# EAGLE design braids_v50 (EAGLE 9.2.2)

## Sheet 1 of 3
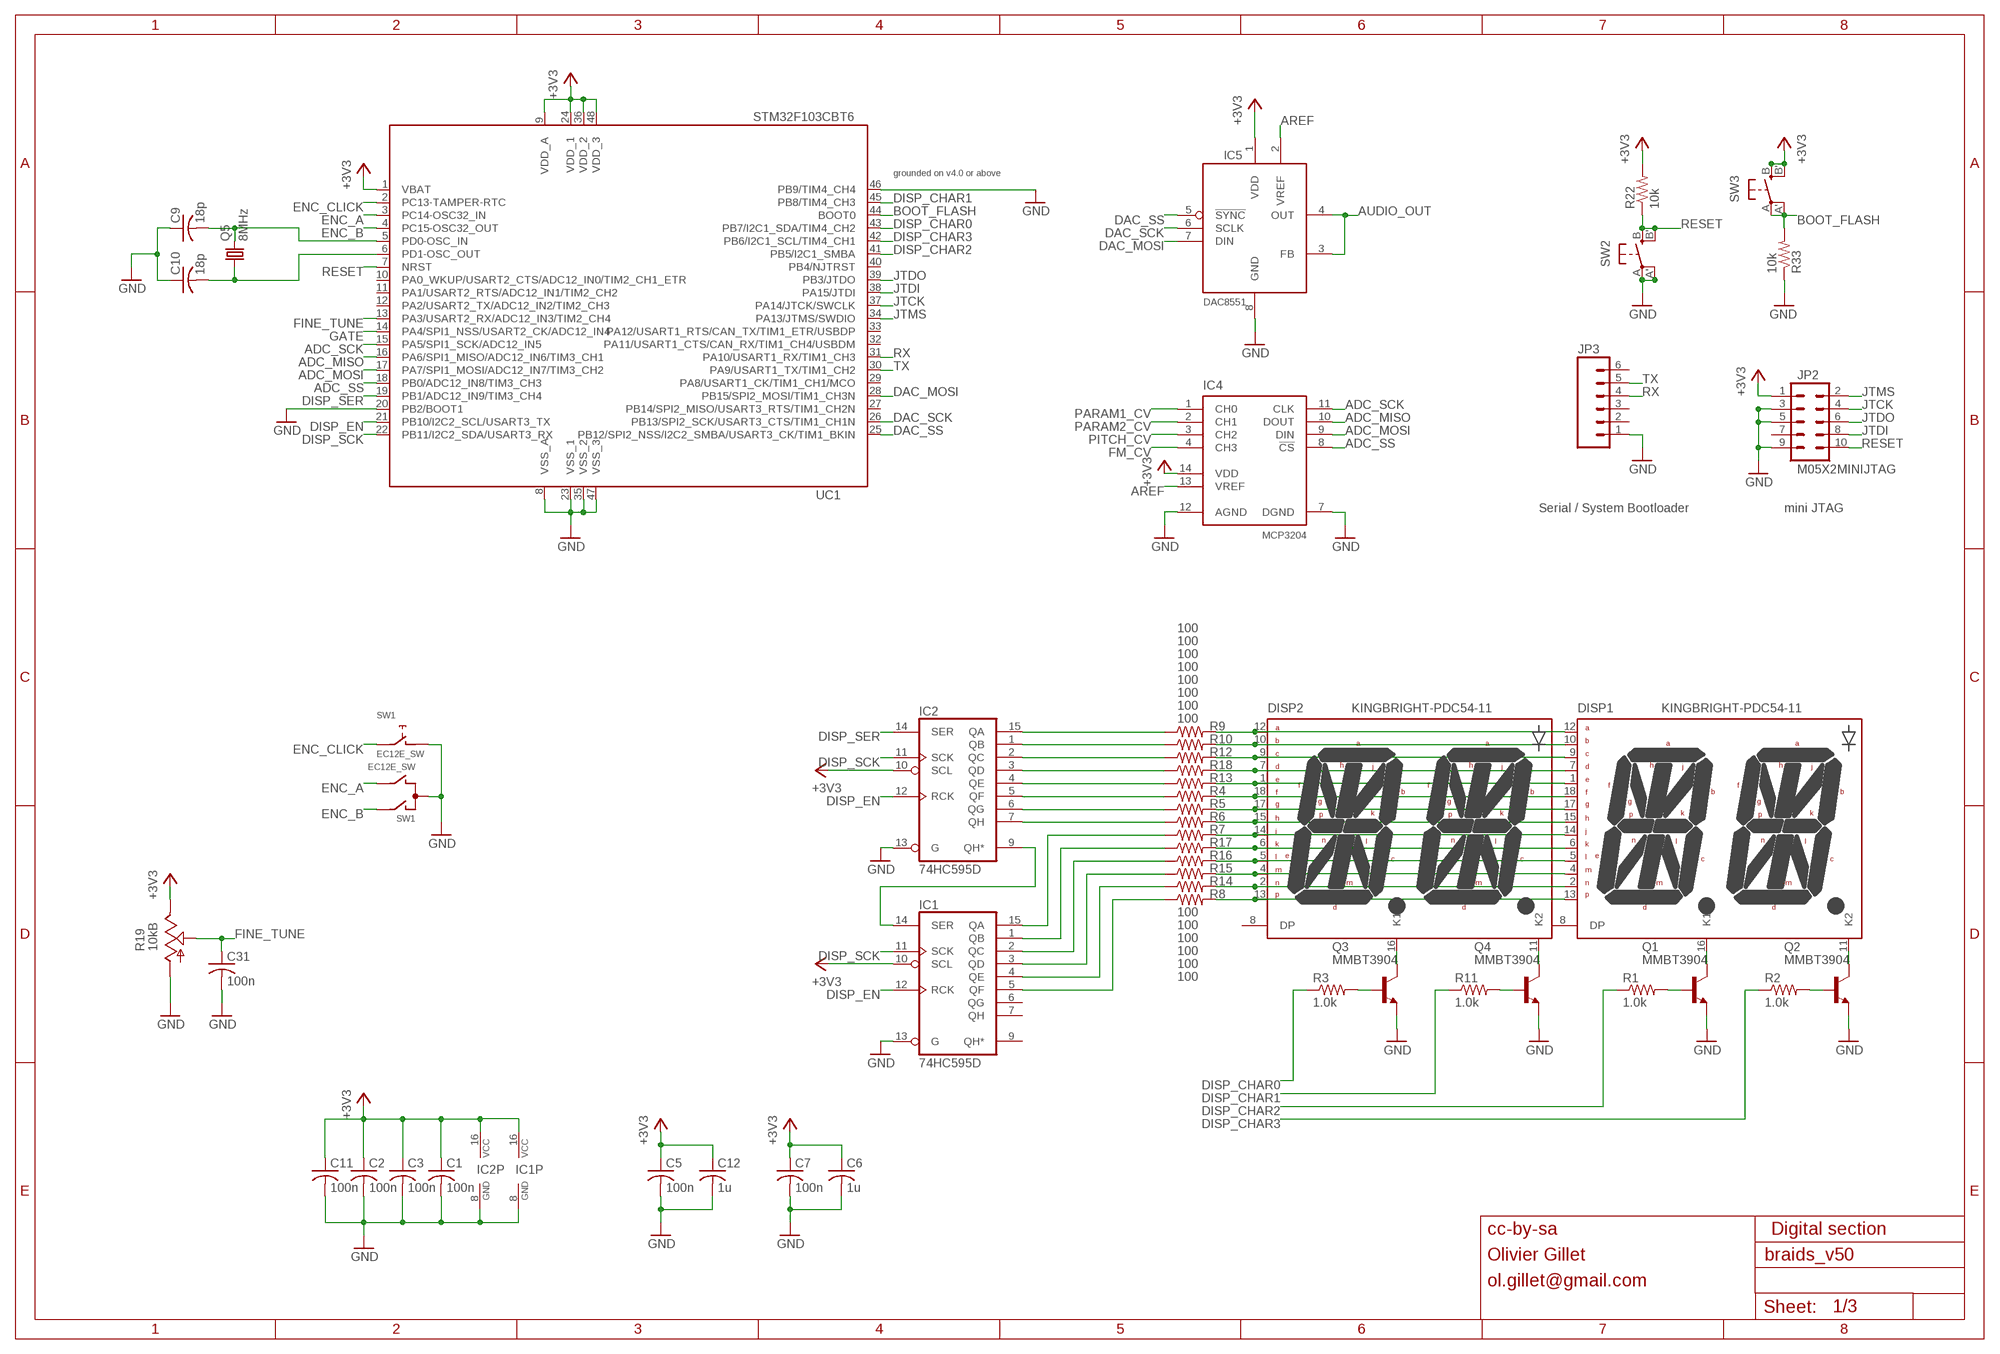
[diagram p0: schematic, sheet 1]

### Parts
C1  100n  C-USC0603  [C0603]
C2  100n  C-USC0603  [C0603]
C3  100n  C-USC0603  [C0603]
C5  100n  C-USC0603  [C0603]
C6  1u  C-USC0603  [C0603]
C7  100n  C-USC0603  [C0603]
C9  18p  C-USC0603  [C0603]
C10  18p  C-USC0603  [C0603]
C11  100n  C-USC0603  [C0603]
C12  1u  C-USC0603  [C0603]
C31  100n  C-USC0603  [C0603]
DISP1  KINGBRIGHT-PDC54-11  [PDC54]
DISP2  KINGBRIGHT-PDC54-11  [PDC54]
IC1  74HC595D  [SO16]
IC2  74HC595D  [SO16]
IC4  MCP3204  MCP3302  [SO14]
IC5  DAC8551  DAC855X  [MSOP-8]
JP2  M05X2MINIJTAG  [2X5-1.27]
JP3  M06SIP  [1X06]
Q1  MMBT3904  MMBT3904LT1-NPN-SOT23-BEC  [SOT23-BEC]
Q2  MMBT3904  MMBT3904LT1-NPN-SOT23-BEC  [SOT23-BEC]
Q3  MMBT3904  MMBT3904LT1-NPN-SOT23-BEC  [SOT23-BEC]
Q4  MMBT3904  MMBT3904LT1-NPN-SOT23-BEC  [SOT23-BEC]
Q5  8MHz  CRYSTALHC49UP  [HC49UP]
R1  1.0k  R-US_R0603  [R0603]
R2  1.0k  R-US_R0603  [R0603]
R3  1.0k  R-US_R0603  [R0603]
R4  100  R-US_R0603  [R0603]
R5  100  R-US_R0603  [R0603]
R6  100  R-US_R0603  [R0603]
R7  100  R-US_R0603  [R0603]
R8  100  R-US_R0603  [R0603]
R9  100  R-US_R0603  [R0603]
R10  100  R-US_R0603  [R0603]
R11  1.0k  R-US_R0603  [R0603]
R12  100  R-US_R0603  [R0603]
R13  100  R-US_R0603  [R0603]
R14  100  R-US_R0603  [R0603]
R15  100  R-US_R0603  [R0603]
R16  100  R-US_R0603  [R0603]
R17  100  R-US_R0603  [R0603]
R18  100  R-US_R0603  [R0603]
R19  10kB  POT_USVERTICAL_PS  [ALPS_POT_VERTICAL_PS]
R22  10k  R-US_R0603  [R0603]
R33  10k  R-US_R0603  [R0603]
SW1  EC12E_SW  [ALPS_EC12E_SW]
SW2  EVQQ2  [EVQ-Q2]
SW3  EVQQ2  [EVQ-Q2]
UC1  STM32F103CBT6  STM32F103CB  [LQFP48]

### Nets
+3V3: C1.1 C2.1 C3.1 C5.1 C6.1 C7.1 C11.1 C12.1 IC1.10(SCL) IC1.16(VCC) IC2.10(SCL) IC2.16(VCC) IC4.14(VDD) IC5.1(VDD) JP2.1 R19.P$1(E) R22.2 SW3.B'(S1) SW3.B(S) UC1.1(VBAT) UC1.9(VDD_A) UC1.24(VDD_1) UC1.36(VDD_2) UC1.48(VDD_3) ; also sheet 2,3
ADC_MISO: IC4.10(DOUT) UC1.16(PA6/SPI1_MISO/ADC12_IN6/TIM3_CH1)
ADC_MOSI: IC4.9(DIN) UC1.17(PA7/SPI1_MOSI/ADC12_IN7/TIM3_CH2)
ADC_SCK: IC4.11(CLK) UC1.15(PA5/SPI1_SCK/ADC12_IN5)
ADC_SS: IC4.8(!CS) UC1.18(PB0/ADC12_IN8/TIM3_CH3)
AREF: IC4.13(VREF) IC5.2(VREF) ; also sheet 3
AUDIO_OUT: IC5.3(FB) IC5.4(OUT) ; also sheet 2
BOOT_FLASH: R33.2 SW3.A'(P1) SW3.A(P) UC1.44(BOOT0)
DAC_MOSI: IC5.7(DIN) UC1.28(PB15/SPI2_MOSI/TIM1_CH3N)
DAC_SCK: IC5.6(SCLK) UC1.26(PB13/SPI2_SCK/USART3_CTS/TIM1_CH1N)
DAC_SS: IC5.5(!SYNC) UC1.25(PB12/SPI2_NSS/I2C2_SMBA/USART3_CK/TIM1_BKIN)
DISP_CHAR0: R3.1 UC1.43(PB7/I2C1_SDA/TIM4_CH2)
DISP_CHAR1: R11.1 UC1.45(PB8/TIM4_CH3)
DISP_CHAR2: R1.1 UC1.41(PB5/I2C1_SMBA)
DISP_CHAR3: R2.1 UC1.42(PB6/I2C1_SCL/TIM4_CH1)
DISP_EN: IC1.12(RCK) IC2.12(RCK) UC1.21(PB10/I2C2_SCL/USART3_TX)
DISP_SCK: IC1.11(SCK) IC2.11(SCK) UC1.22(PB11/I2C2_SDA/USART3_RX)
DISP_SER: IC2.14(SER) UC1.19(PB1/ADC12_IN9/TIM3_CH4)
ENC_A: SW1.B UC1.3(PC14-OSC32_IN)
ENC_B: SW1.A UC1.4(PC15-OSC32_OUT)
ENC_CLICK: SW1.E UC1.2(PC13-TAMPER-RTC)
FINE_TUNE: C31.1 R19.P$2(S) UC1.13(PA3/USART2_RX/ADC12_IN3/TIM2_CH4)
FM_CV: IC4.4(CH3) ; also sheet 2
GATE: UC1.14(PA4/SPI1_NSS/USART2_CK/ADC12_IN4) ; also sheet 2
GND: C1.2 C2.2 C3.2 C5.2 C6.2 C7.2 C9.1 C10.1 C11.2 C12.2 C31.2 IC1.8(GND) IC1.13(G) IC2.8(GND) IC2.13(G) IC4.7(DGND) IC4.12(AGND) IC5.8(GND) JP2.3 JP2.5 JP2.9 JP3.1 Q1.E Q2.E Q3.E Q4.E R19.P$3(A) R33.1 SW1.C SW1.D SW2.A'(P1) SW2.A(P) UC1.8(VSS_A) UC1.20(PB2/BOOT1) UC1.23(VSS_1) UC1.35(VSS_2) UC1.46(PB9/TIM4_CH4) UC1.47(VSS_3) ; also sheet 2,3
JTCK: JP2.4 UC1.37(PA14/JTCK/SWCLK)
JTDI: JP2.8 UC1.38(PA15/JTDI)
JTDO: JP2.6 UC1.39(PB3/JTDO)
JTMS: JP2.2 UC1.34(PA13/JTMS/SWDIO)
N$1: DISP2.16(K1) Q3.C
N$2: DISP2.11(K2) Q4.C
N$3: DISP1.16(K1) Q1.C
N$4: DISP1.11(K2) Q2.C
N$5: Q3.B R3.2
N$6: Q4.B R11.2
N$7: C9.2 Q5.2 UC1.5(PD0-OSC_IN)
N$8: C10.2 Q5.1 UC1.6(PD1-OSC_OUT)
N$9: Q1.B R1.2
N$10: Q2.B R2.2
N$15: DISP1.12(A) DISP2.12(A) R9.2
N$16: DISP1.10(B) DISP2.10(B) R10.2
N$17: DISP1.9(C) DISP2.9(C) R12.2
N$18: DISP1.7(D) DISP2.7(D) R18.2
N$19: DISP1.1(E) DISP2.1(E) R13.2
N$20: DISP1.18(F) DISP2.18(F) R4.2
N$21: DISP1.17(G) DISP2.17(G) R5.2
N$22: DISP1.15(H) DISP2.15(H) R6.2
N$23: DISP1.14(J) DISP2.14(J) R7.2
N$24: DISP1.6(K) DISP2.6(K) R17.2
N$25: DISP1.5(L) DISP2.5(L) R16.2
N$26: DISP1.4(M) DISP2.4(M) R15.2
N$27: DISP1.2(N) DISP2.2(N) R14.2
N$28: DISP1.13(P) DISP2.13(P) R8.2
N$30: IC2.7(QH) R6.1
N$31: IC1.14(SER) IC2.9(QH*)
N$32: IC2.15(QA) R9.1
N$33: IC2.1(QB) R10.1
N$34: IC2.2(QC) R12.1
N$35: IC2.3(QD) R18.1
N$36: IC2.4(QE) R13.1
N$37: IC2.5(QF) R4.1
N$38: IC2.6(QG) R5.1
N$39: IC1.15(QA) R7.1
N$40: IC1.1(QB) R17.1
N$41: IC1.2(QC) R16.1
N$42: IC1.3(QD) R15.1
N$43: IC1.4(QE) R14.1
N$44: IC1.5(QF) R8.1
PARAM1_CV: IC4.1(CH0) ; also sheet 2
PARAM2_CV: IC4.2(CH1) ; also sheet 2
PITCH_CV: IC4.3(CH2) ; also sheet 2
RESET: JP2.10 R22.1 SW2.B'(S1) SW2.B(S) UC1.7(NRST)
RX: JP3.4 UC1.31(PA10/USART1_RX/TIM1_CH3)
TX: JP3.5 UC1.30(PA9/USART1_TX/TIM1_CH2)
Unconnected: DISP1.8(DP) DISP2.8(DP) IC1.6(QG) IC1.7(QH) IC1.9(QH*) JP2.7 JP3.2 JP3.3 JP3.6 SW1.GND1(G) SW1.GND2(G) UC1.10(PA0_WKUP/USART2_CTS/ADC12_IN0/TIM2_CH1_ETR) UC1.11(PA1/USART2_RTS/ADC12_IN1/TIM2_CH2) UC1.12(PA2/USART2_TX/ADC12_IN2/TIM2_CH3) UC1.27(PB14/SPI2_MISO/USART3_RTS/TIM1_CH2N) UC1.29(PA8/USART1_CK/TIM1_CH1/MCO) UC1.32(PA11/USART1_CTS/CAN_RX/TIM1_CH4/USBDM) UC1.33(PA12/USART1_RTS/CAN_TX/TIM1_ETR/USBDP) UC1.40(PB4/NJTRST)

### Notes on the sheet
- grounded on v4.0 or above
- Serial / System Bootloader | mini JTAG
- cc-by-sa | Digital section
- Olivier Gillet
- ol.gillet@gmail.com

## Sheet 2 of 3
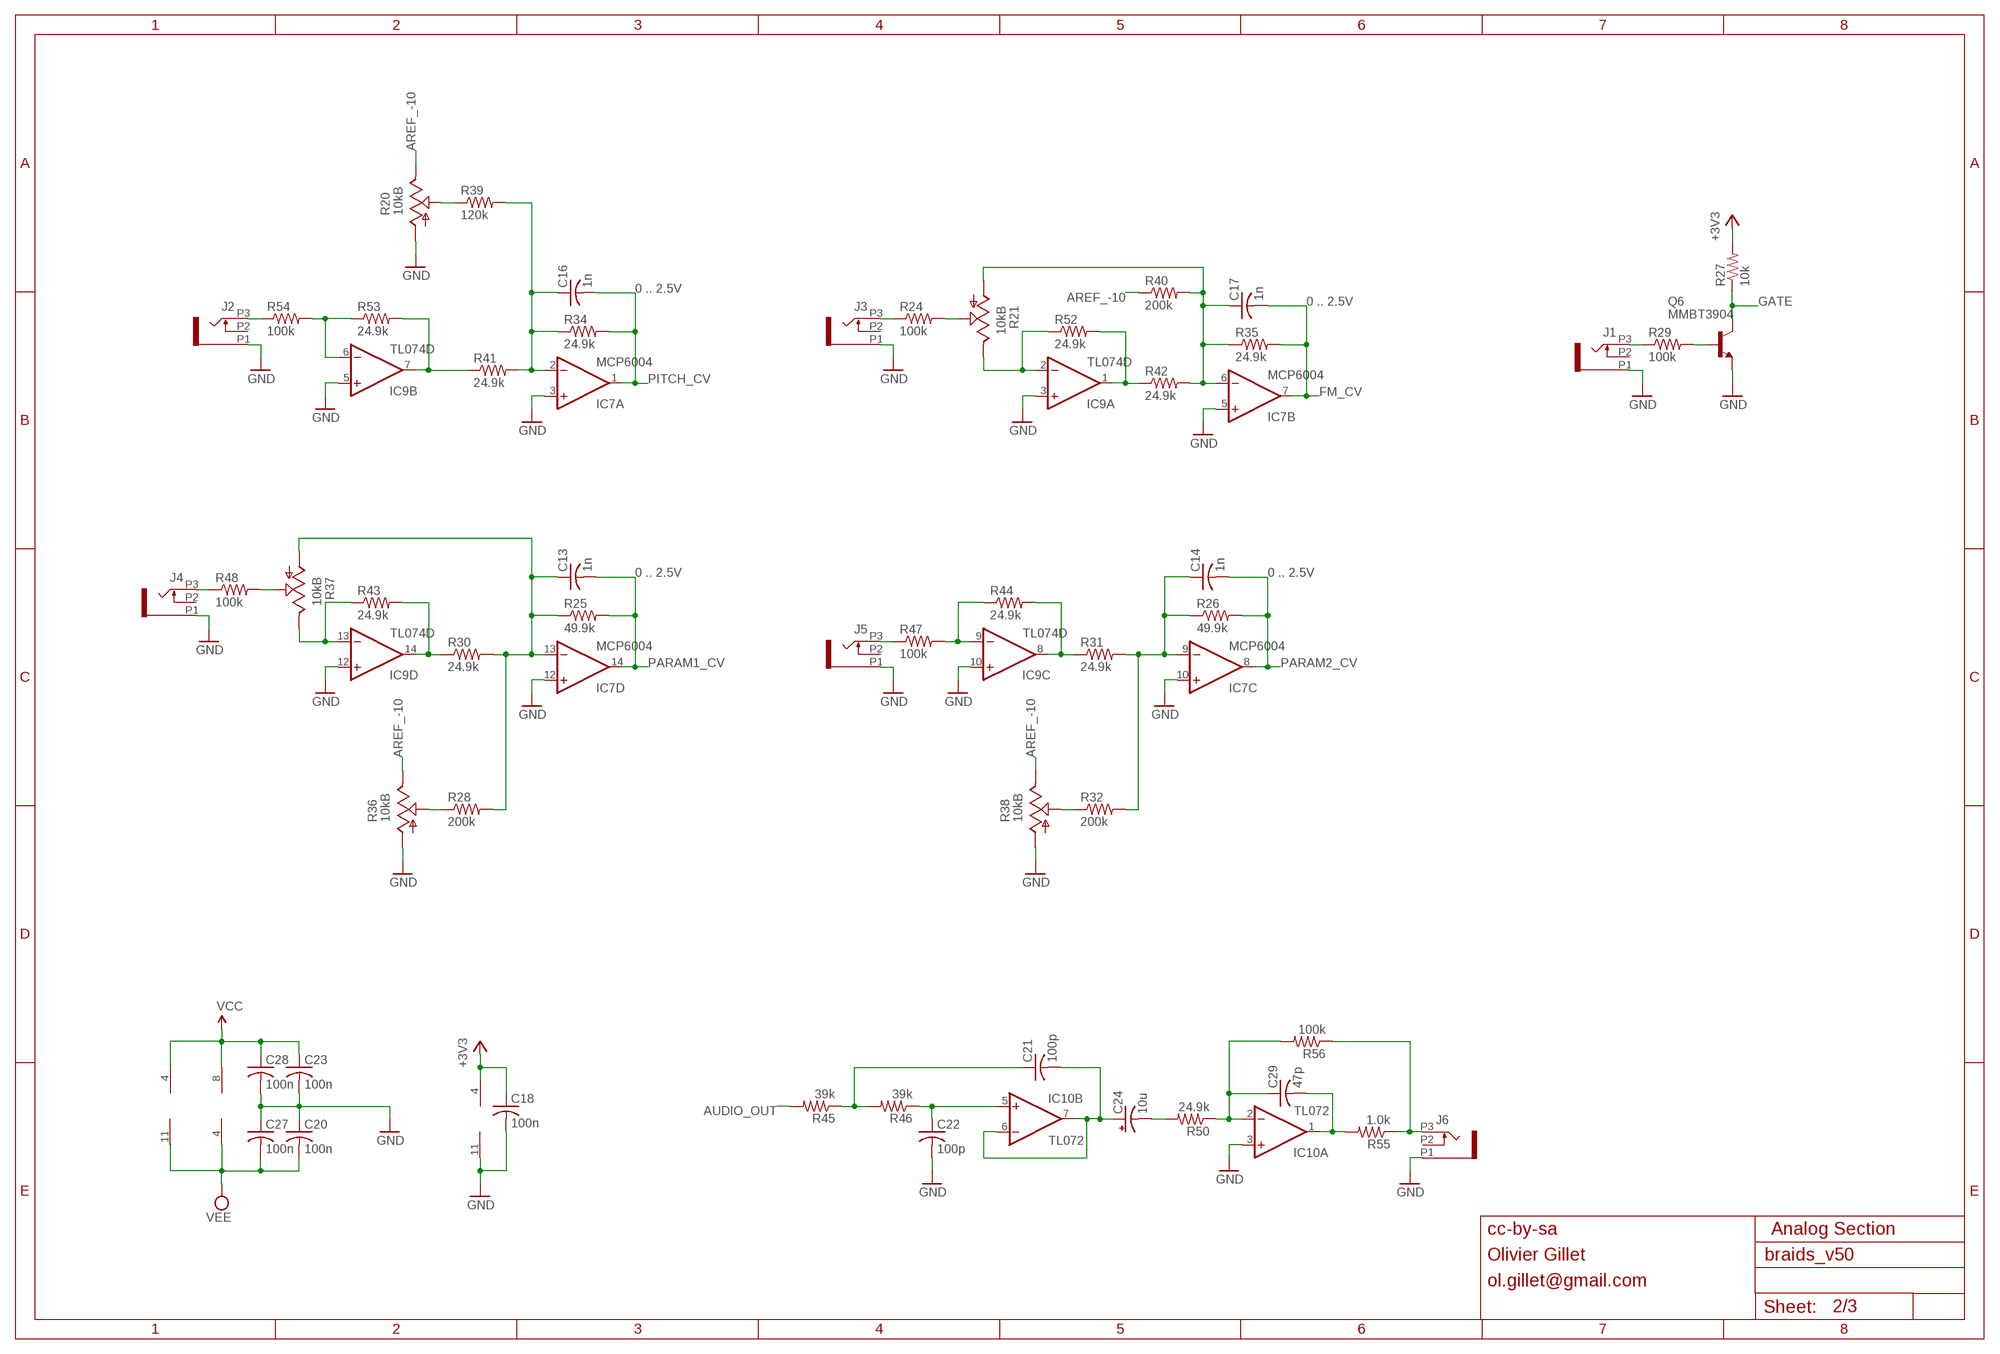
[diagram p1: schematic, sheet 2]

### Parts
C13  1n  C-USC0603  [C0603]
C14  1n  C-USC0603  [C0603]
C16  1n  C-USC0603  [C0603]
C17  1n  C-USC0603  [C0603]
C18  100n  C-USC0603  [C0603]
C20  100n  C-USC0603  [C0603]
C21  100p  C-USC0603  [C0603]
C22  100p  C-USC0603  [C0603]
C23  100n  C-USC0603  [C0603]
C24  10u  CPOL-USB  [PANASONIC_B]
C27  100n  C-USC0603  [C0603]
C28  100n  C-USC0603  [C0603]
C29  47p  C-USC0603  [C0603]
IC7  MCP6004  TL074D  [SO14]
IC9  TL074D  [SO14]
IC10  TL072  TL072D  [SO08]
J1  PJ301_THONKICONN6  [WQP_PJ_301M6]
J2  PJ301_THONKICONN6  [WQP_PJ_301M6]
J3  PJ301_THONKICONN6  [WQP_PJ_301M6]
J4  PJ301_THONKICONN6  [WQP_PJ_301M6]
J5  PJ301_THONKICONN6  [WQP_PJ_301M6]
J6  PJ301_THONKICONN6  [WQP_PJ_301M6]
Q6  MMBT3904  MMBT3904LT1-NPN-SOT23-BEC  [SOT23-BEC]
R20  10kB  POT_USVERTICAL_PS  [ALPS_POT_VERTICAL_PS]
R21  10kB  POT_USVERTICAL_PS  [ALPS_POT_VERTICAL_PS]
R24  100k  R-US_R0603  [R0603]
R25  49.9k  R-US_R0603  [R0603]
R26  49.9k  R-US_R0603  [R0603]
R27  10k  R-US_R0603  [R0603]
R28  200k  R-US_R0603  [R0603]
R29  100k  R-US_R0603  [R0603]
R30  24.9k  R-US_R0603  [R0603]
R31  24.9k  R-US_R0603  [R0603]
R32  200k  R-US_R0603  [R0603]
R34  24.9k  R-US_R0603  [R0603]
R35  24.9k  R-US_R0603  [R0603]
R36  10kB  POT_USVERTICAL_PS  [ALPS_POT_VERTICAL_PS]
R37  10kB  POT_USVERTICAL_PS  [ALPS_POT_VERTICAL_PS]
R38  10kB  POT_USVERTICAL_PS  [ALPS_POT_VERTICAL_PS]
R39  120k  R-US_R0603  [R0603]
R40  200k  R-US_R0603  [R0603]
R41  24.9k  R-US_R0603  [R0603]
R42  24.9k  R-US_R0603  [R0603]
R43  24.9k  R-US_R0603  [R0603]
R44  24.9k  R-US_R0603  [R0603]
R45  39k  R-US_R0603  [R0603]
R46  39k  R-US_R0603  [R0603]
R47  100k  R-US_R0603  [R0603]
R48  100k  R-US_R0603  [R0603]
R50  24.9k  R-US_R0603  [R0603]
R52  24.9k  R-US_R0603  [R0603]
R53  24.9k  R-US_R0603  [R0603]
R54  100k  R-US_R0603  [R0603]
R55  1.0k  R-US_R0603  [R0603]
R56  100k  R-US_R0603  [R0603]

### Nets
+3V3: C18.1 IC7.4(P:V+) R27.2 ; also sheet 1,3
AREF_-10: R20.P$1(E) R36.P$1(E) R38.P$1(E) R40.1 ; also sheet 3
AUDIO_OUT: R45.2 ; also sheet 1
FM_CV: C17.2 IC7.7(B:OUT) R35.2 ; also sheet 1
GATE: Q6.C R27.1 ; also sheet 1
GND: C18.2 C20.1 C22.2 C23.2 C27.1 C28.2 IC7.3(A:+IN) IC7.5(B:+IN) IC7.10(C:+IN) IC7.11(P:V-) IC7.12(D:+IN) IC9.3(A:+IN) IC9.5(B:+IN) IC9.10(C:+IN) IC9.12(D:+IN) IC10.3(A:+IN) J1.P1 J2.P1 J3.P1 J4.P1 J5.P1 J6.P1 Q6.E R20.P$3(A) R36.P$3(A) R38.P$3(A) ; also sheet 1,3
N$12: IC9.7(B:OUT) R41.1 R53.2
N$13: R20.P$2(S) R39.1
N$14: J2.P3 R54.1
N$29: C16.1 IC7.2(A:-IN) R34.1 R39.2 R41.2
N$45: IC9.6(B:-IN) R53.1 R54.2
N$46: J3.P3 R24.1
N$47: J4.P3 R48.1
N$48: R21.P$2(S) R24.2
N$50: IC9.13(D:-IN) R37.P$1(E) R43.1
N$51: IC9.14(D:OUT) R30.1 R43.2
N$52: IC9.2(A:-IN) R21.P$1(E) R52.1
N$53: IC9.1(A:OUT) R42.1 R52.2
N$55: C17.1 IC7.6(B:-IN) R21.P$3(A) R35.1 R40.2 R42.2
N$57: J1.P3 R29.1
N$58: IC9.8(C:OUT) R31.1 R44.2
N$59: C13.1 IC7.13(D:-IN) R25.1 R28.2 R30.2 R37.P$3(A)
N$60: J5.P3 R47.1
N$61: R28.1 R36.P$2(S)
N$62: R37.P$2(S) R48.2
N$63: IC9.9(C:-IN) R44.1 R47.2
N$65: R32.1 R38.P$2(S)
N$66: Q6.B R29.2
N$67: C21.2 C24.+ IC10.6(B:-IN) IC10.7(B:OUT)
N$68: C24.- R50.2
N$69: C22.1 IC10.5(B:+IN) R46.1
N$70: C14.1 IC7.9(C:-IN) R26.1 R31.2 R32.2
N$71: C21.1 R45.1 R46.2
N$72: J6.P3 R55.1 R56.1
N$73: C29.2 IC10.1(A:OUT) R55.2
N$75: C29.1 IC10.2(A:-IN) R50.1 R56.2
PARAM1_CV: C13.2 IC7.14(D:OUT) R25.2 ; also sheet 1
PARAM2_CV: C14.2 IC7.8(C:OUT) R26.2 ; also sheet 1
PITCH_CV: C16.2 IC7.1(A:OUT) R34.2 ; also sheet 1
VCC: C23.1 C28.1 IC9.4(P:V+) IC10.8(P:V+) ; also sheet 3
VEE: C20.2 C27.2 IC9.11(P:V-) IC10.4(P:V-) ; also sheet 3
Unconnected: J1.P2 J2.P2 J3.P2 J4.P2 J5.P2 J6.P2

### Notes on the sheet
- 0 .. 2.5V
- 0 .. 2.5V
- 0 .. 2.5V | 0 .. 2.5V
- cc-by-sa | Analog Section
- Olivier Gillet
- ol.gillet@gmail.com

## Sheet 3 of 3
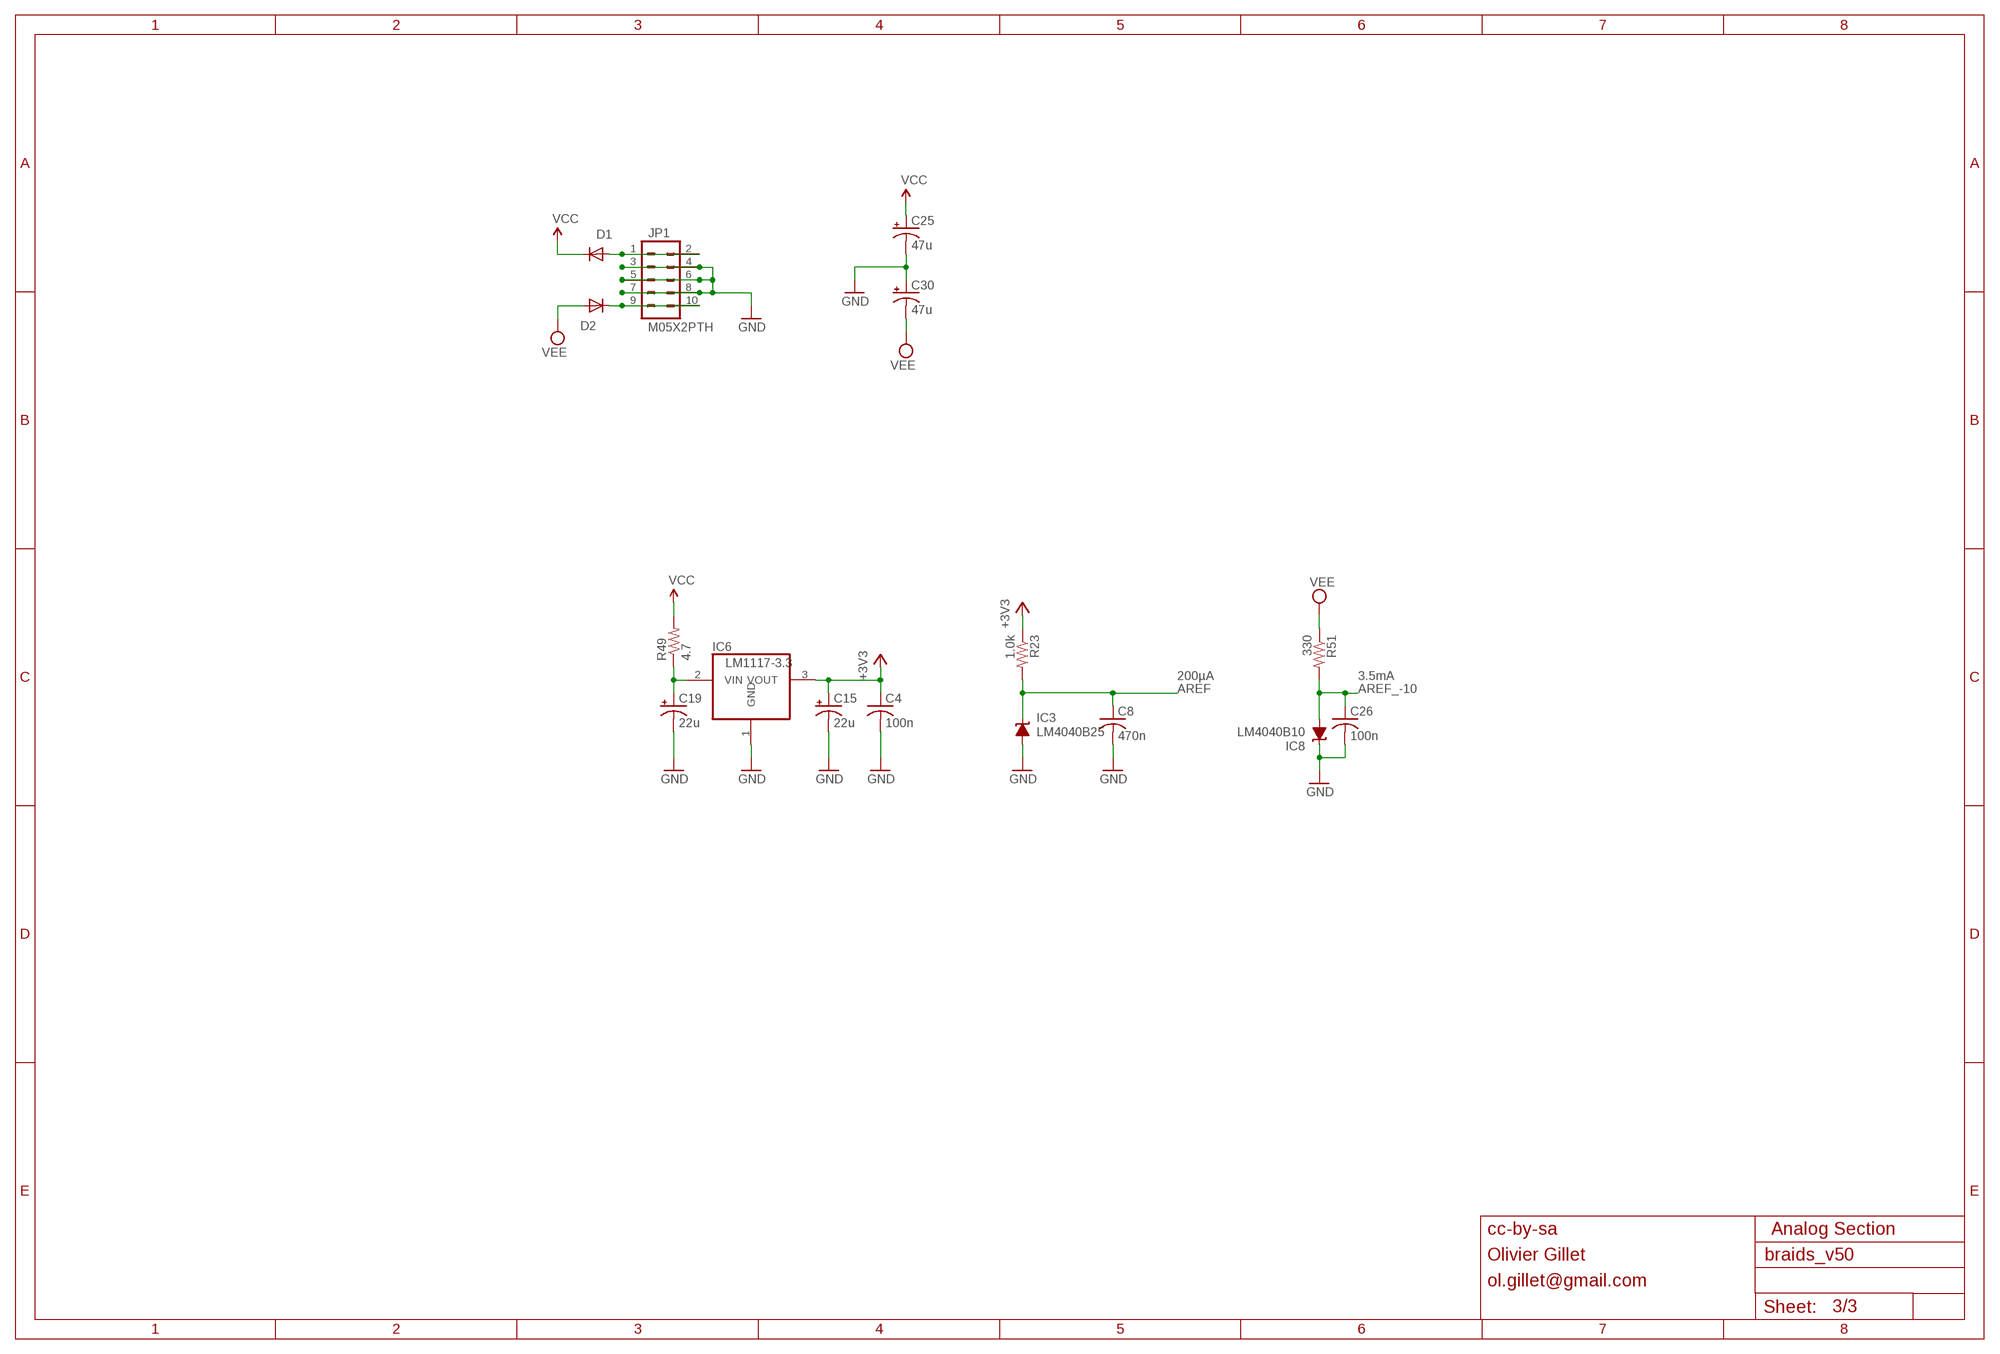
[diagram p2: schematic, sheet 3]

### Parts
C4  100n  C-USC0603  [C0603]
C8  470n  C-USC0603  [C0603]
C15  22u  CPOL-USC  [PANASONIC_C]
C19  22u  CPOL-USC  [PANASONIC_C]
C25  47u  CPOL-USD  [PANASONIC_D]
C26  100n  C-USC0603  [C0603]
C30  47u  CPOL-USD  [PANASONIC_D]
D1  1N5819HW  DIODE-SOD123  [SOD123]
D2  1N5819HW  DIODE-SOD123  [SOD123]
IC3  LM4040B25  LM4041B12DBZ  [DBZ_R-PDSO-G3]
IC6  LM1117-3.3  REG1117T  [TO252]
IC8  LM4040B10  LM4041B12DBZ  [DBZ_R-PDSO-G3]
JP1  M05X2PTH  [AVR_ICSP]
R23  1.0k  R-US_R0603  [R0603]
R49  4.7  R-US_R1206  [R1206]
R51  330  R-US_R0603  [R0603]

### Nets
+3V3: C4.1 C15.+ IC6.3(VOUT) R23.1 ; also sheet 1,2
AREF: C8.1 IC3.1(C) R23.2 ; also sheet 1
AREF_-10: C26.1 IC8.2(A) R51.2 ; also sheet 2
GND: C4.2 C8.2 C15.- C19.- C25.- C26.2 C30.+ IC3.2(A) IC6.1(GND) IC8.1(C) JP1.3 JP1.4 JP1.5 JP1.6 JP1.7 JP1.8 ; also sheet 1,2
N$49: C19.+ IC6.2(VIN) R49.1
N$56: D1.A JP1.1 JP1.2
N$64: D2.C JP1.9 JP1.10
VCC: C25.+ D1.C R49.2 ; also sheet 2
VEE: C30.- D2.A R51.1 ; also sheet 2

### Notes on the sheet
- 200µA | 3.5mA
- cc-by-sa | Analog Section
- Olivier Gillet
- ol.gillet@gmail.com

## Library data of the parts
C1-C14 C16-C18 C20-C23 C26-C29 C31 = rcl:C-US: CAPACITOR, American symbol
C15 C19 C24 C25 C30 = rcl:CPOL-US: POLARIZED CAPACITOR, American symbol
D1 D2 = diode:DIODE-: DIODE
DISP1 DISP2 = og-display:KINGBRIGHT-PDC54-11: Kingbright PDC54-11GWA ; also compatible with LITE-On LTP-3784G or Avago HDSP-A27C
IC1 IC2 = 74xx-eu:74*595: 8-bit SHIFT REGISTER, output latch
IC3 IC8 = texas:LM4041: PRECISION MICROPOWER SHUNT VOLTAGE REFERENCE Source: http://focus.ti.com/lit/ds/slcs146e/slcs146e.pdf
IC4 = og-adc:MCP3302
IC5 = og-dac:DAC855X: 16-bit low-glitch DAC with 2's complement (8550) or unsigned code (8551)
IC6 = og-vreg:REG1117: 800mA and 1A Low Dropout (LDO) Positive Regulator 1.8V, 2.5V, 2.85V, 3.3V, 5V, and Adj
IC7 IC9 = gm-ics:TL074: OP AMP
IC10 = linear:TL072: OP AMP
J1-J6 = og-pj301:PJ301_THONKICONN
JP1 JP2 = og-header:M05X2: Header 5x2 Standard 10-pin dual row 0.1" header. Commonly used with AVR-ISP. Use with Spark Fun Electronics SKU: PRT-00778
JP3 = SparkFun:M06: Header 6 Standard 6-pin 0.1" header. Use with straight break away headers (SKU : PRT-00116), right angle break away headers (PRT-00553), swiss pins (PRT-00743), machine pins (PRT-00117), and female headers (PRT-00115). Molex polarized connector foot print use with SKU : PRT-08094 with associated crimp pins and housings. NOTES ON THE VARIANTS LOCK and LOCK_LONGPADS... This footprint was designed to help hold the alignment of a through-hole component (i.e. 6-pin header) while soldering it into place. You may notice that each hole has been shifted either up or down by 0.005 of an inch from it's more standard position (which is a perfectly straight line). This slight alteration caused the pins (the squares in the middle) to touch the edges of the holes. Because they are alternating, it causes a "brace" to hold the component in place. 0.005 has proven to be the perfect amount of "off-center" position when using our standard breakaway headers. Although looks a little odd when you look at the bare footprint, once you have a header in there, the alteration is very hard to notice. Also, if you push a header all the way into place, it is covered up entirely on the bottom side. This idea of altering the position of holes to aid alignment will be further integrated into the Sparkfun Library for other footprints. It can help hold any component with 3 or more connection pins.
Q1-Q4 Q6 = transistor:*-NPN-: NPN Transistror BF959 corrected 2008.03.06
Q5 = crystal:CRYSTAL: CRYSTAL
R1-R18 R22-R35 R39-R56 = rcl:R-US_: RESISTOR, American symbol
R19-R21 R36-R38 = pot-alps:POT_US
SW1 = og-encoder:EC12E_SW: ALPS rotary Encoder EC12E series with switch
SW2 SW3 = adafruit:EVQQ2: SMT 6mm switch, EVQQ2 series http://www.ladyada.net/library/eagle
UC1 = stm32:STM32F103CB

## Board
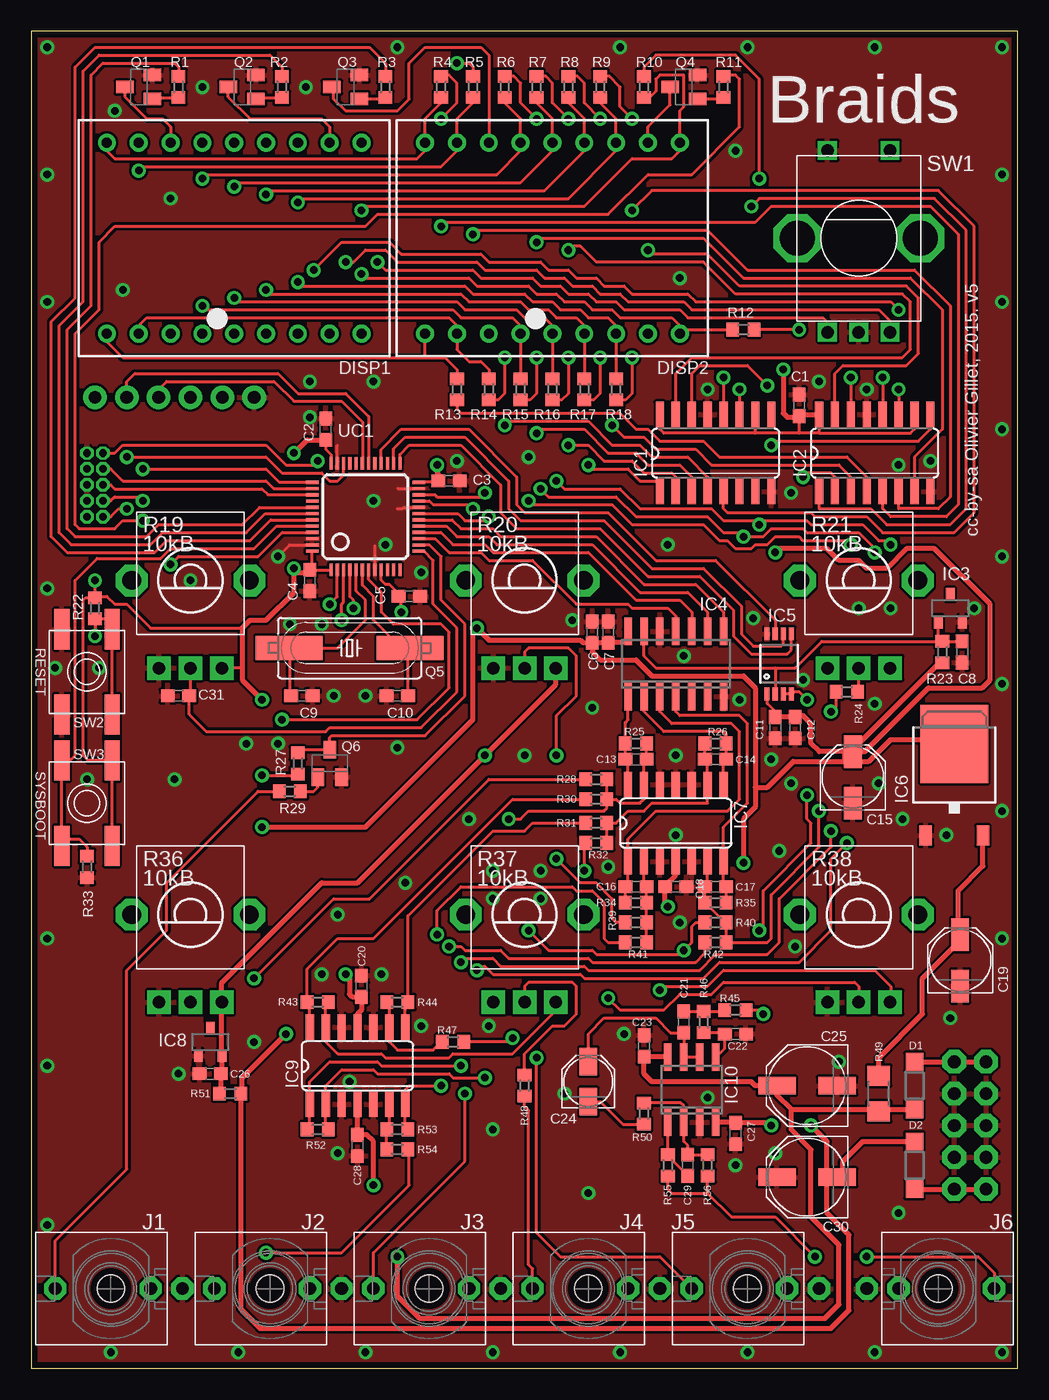
[diagram p3: board, top side]
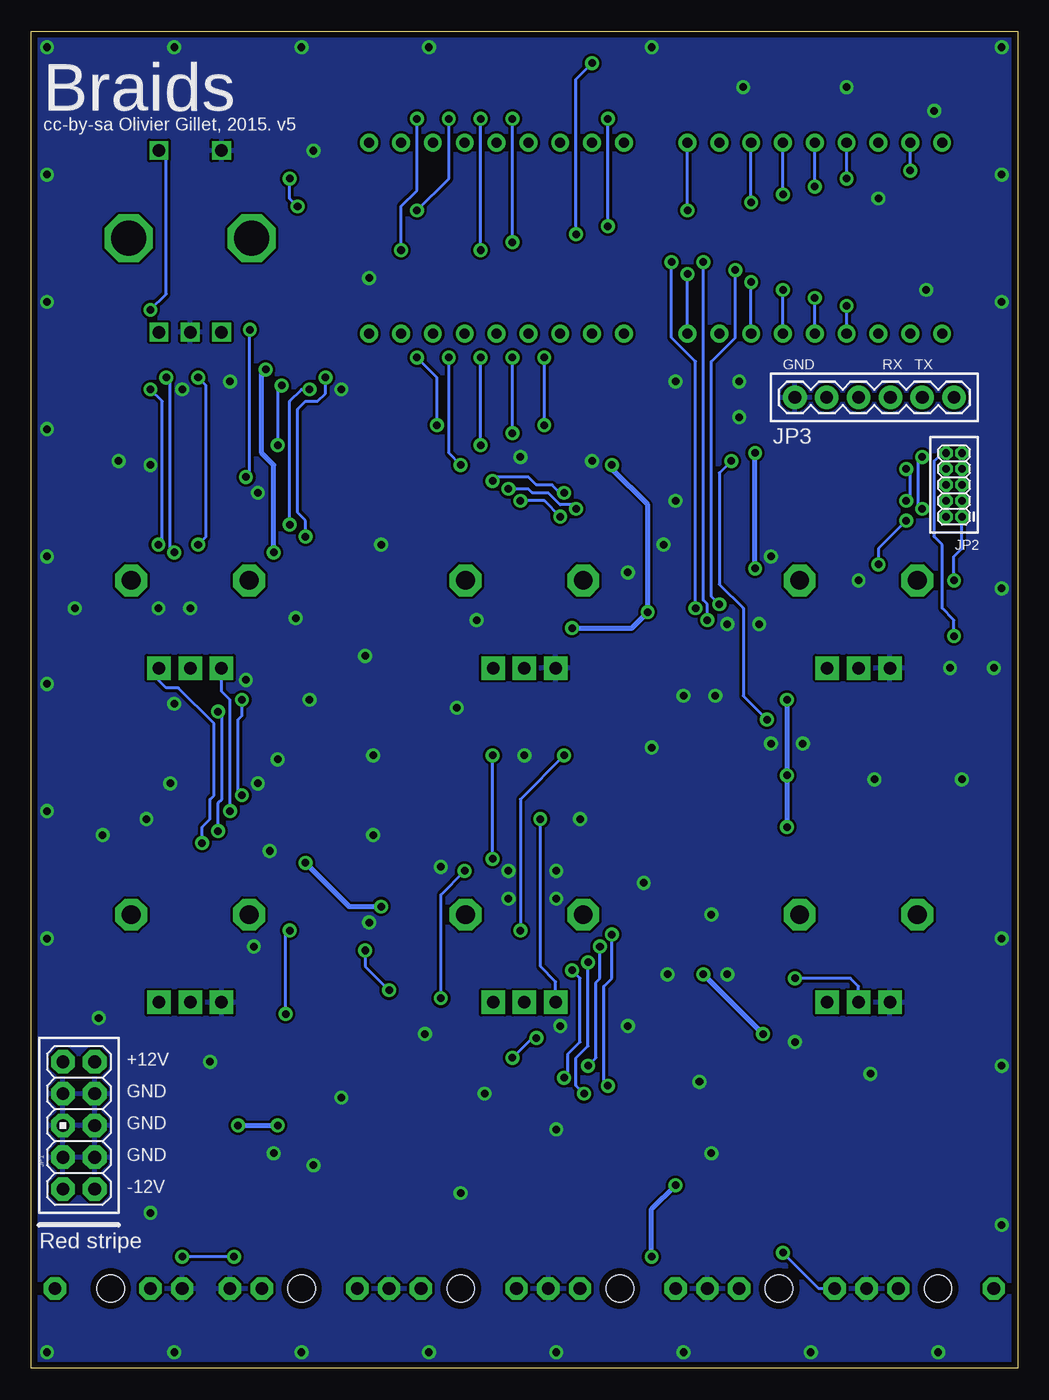
[diagram p4: board, bottom side, seen from below]

Size 78.72 x 106.68 mm. Coordinates in mm from the lower left corner, seen from the top.
Outline: 0,0 78.72,0 78.72,106.68 0,106.68 0,0
Copper layers (1*16): Top 0.035mm / dielectric 1.5mm / Bottom 0.035mm
Design rules "PCBCart-Standard *": minimum track width 8mil, minimum drill 0.4mm, track to track 8mil, track to pad 8mil, pad to pad 8mil, via to via 8mil, smd to smd 8mil, copper to edge 20mil, drill to drill 8mil, minimum pad ring 8mil, minimum via ring 10mil, stop-mask expansion 3mil, vias tented up to drill 25mil, thermal gap 8mil

### Footprints (pad centres in the part's own frame; a part is rotated, then mirrored left to right if it is on the bottom)
C0603 = smd 1.1 x 1: 1 -0.85,0; 2 0.85,0
PANASONIC_C = smd 2.6 x 1.4: + 2.05,0; - -2.05,0
PANASONIC_B = smd 2.2 x 1.4: + 1.6,0; - -1.6,0
PANASONIC_D = smd 3 x 1.4: + 2.4,0; - -2.4,0
SOD123 = smd 1.4 x 1.4: A 1.9,0; C -1.9,0
PDC54 = drill 0.8 pad 1.422: 1 -10.16,-7.62; 2 -7.62,-7.62; 3 -5.08,-7.62; 4 -2.54,-7.62; 5 0,-7.62; 6 2.54,-7.62; 7 5.08,-7.62; 8 7.62,-7.62; 9 10.16,-7.62; 10 10.16,7.62; 11 7.62,7.62; 12 5.08,7.62; 13 2.54,7.62; 14 0,7.62; 15 -2.54,7.62; 16 -5.08,7.62; 17 -7.62,7.62; 18 -10.16,7.62
SO16 = smd 0.66 x 2.032: 1 -4.445,-3.073; 2 -3.175,-3.073; 3 -1.905,-3.073; 4 -0.635,-3.073; 5 0.635,-3.073; 6 1.905,-3.073; 7 3.175,-3.073; 8 4.445,-3.073; 9 4.445,3.073; 10 3.175,3.073; 11 1.905,3.073; 12 0.635,3.073; 13 -0.635,3.073; 14 -1.905,3.073; 15 -3.175,3.073; 16 -4.445,3.073
DBZ_R-PDSO-G3 = smd 0.7 x 1: 1 -0.95,-1.1; 2 0.95,-1.1; 3 0,1.1
SO14 = smd 0.6 x 2.2: 1 -3.81,-2.6; 2 -2.54,-2.6; 3 -1.27,-2.6; 4 0,-2.6; 5 1.27,-2.6; 6 2.54,-2.6; 7 3.81,-2.6; 8 3.81,2.6; 9 2.54,2.6; 10 1.27,2.6; 11 0,2.6; 12 -1.27,2.6; 13 -2.54,2.6; 14 -3.81,2.6
MSOP-8 = smd 0.41 x 1.02: 1 -0.975,-2.4; 2 -0.325,-2.4; 3 0.325,-2.4; 4 0.975,-2.4; 5 0.975,2.4; 6 0.325,2.4; 7 -0.325,2.4; 8 -0.975,2.4
TO252 = smd 1 x 1.6: 1 -2.28,-4.8; 2 2.28,-4.8 | smd 5.4 x 6.2: 3 0,2.5
SO14' = smd 0.66 x 2.032: 1 -3.81,-3.073; 2 -2.54,-3.073; 3 -1.27,-3.073; 4 0,-3.073; 5 1.27,-3.073; 6 2.54,-3.073; 7 3.81,-3.073; 8 3.81,3.073; 9 2.54,3.073; 10 1.27,3.073; 11 0,3.073; 12 -1.27,3.073; 13 -2.54,3.073; 14 -3.81,3.073
SO08 = smd 0.6 x 2.2: 1 -1.905,-2.6; 2 -0.635,-2.6; 3 0.635,-2.6; 4 1.905,-2.6; 5 1.905,2.6; 6 0.635,2.6; 7 -0.635,2.6; 8 -1.905,2.6
WQP_PJ_301M6 = drill 1.016 pad 1.778 octagon: P1 0,-5.715; P2 0,-3.175; P3 0,4.445 | hole 2.2: 0,0
AVR_ICSP = drill 1.016 pad 1.88 octagon: 1 -1.27,5.08; 2 1.27,5.08; 3 -1.27,2.54; 4 1.27,2.54; 5 -1.27,0; 6 1.27,0; 7 -1.27,-2.54; 8 1.27,-2.54; 9 -1.27,-5.08; 10 1.27,-5.08
2X5-1.27 = drill 0.61 pad 1.067 octagon: 1 -1.27,3.81; 2 0,3.81; 3 -1.27,2.54; 4 0,2.54; 5 -1.27,1.27; 6 0,1.27; 7 -1.27,0; 8 0,0; 9 -1.27,-1.27; 10 0,-1.27
1X06 = drill 1.016 pad 1.88: 1 0,0; 2 2.54,0; 3 5.08,0; 4 7.62,0; 5 10.16,0; 6 12.7,0
SOT23-BEC = smd 1 x 1.4: B -0.95,-1.1; C 0,1.1; E 0.95,-1.1
HC49UP = smd 5.334 x 1.93: 1 -4.826,0; 2 4.826,0
R0603 = smd 1 x 1.1: 1 -0.85,0; 2 0.85,0
ALPS_POT_VERTICAL_PS = drill 1 pad 1.88 square: P$1 -2.5,7; P$2 0,7; P$3 2.5,7 | drill 1.5 pad 2.54 octagon: P$4 -4.7,0; P$5 4.7,0
R1206 = smd 1.6 x 1.803: 1 -1.422,0; 2 1.422,0
ALPS_EC12E_SW = drill 1 square: A -2.5,-7.5; B 2.5,-7.5; C 0,-7.5; D -2.5,7; E 2.5,7 | drill 2.8 octagon: GND1 -4.9,0; GND2 4.9,0
EVQ-Q2 = smd 3.2 x 1.2: A -3.4,-2; A' 3.4,-2; B -3.4,2; B' 3.4,2
LQFP48 = smd 0.254 x 1: 1 -2.75,-4.25; 2 -2.25,-4.25; 3 -1.75,-4.25; 4 -1.25,-4.25; 5 -0.75,-4.25; 6 -0.25,-4.25; 7 0.25,-4.25; 8 0.75,-4.25; 9 1.25,-4.25; 10 1.75,-4.25; 11 2.25,-4.25; 12 2.75,-4.25; 25 2.75,4.25; 26 2.25,4.25; 27 1.75,4.25; 28 1.25,4.25; 29 0.75,4.25; 30 0.25,4.25; 31 -0.25,4.25; 32 -0.75,4.25; 33 -1.25,4.25; 34 -1.75,4.25; 35 -2.25,4.25; 36 -2.75,4.25 | smd 1 x 0.254: 13 4.25,-2.75; 14 4.25,-2.25; 15 4.25,-1.75; 16 4.25,-1.25; 17 4.25,-0.75; 18 4.25,-0.25; 19 4.25,0.25; 20 4.25,0.75; 21 4.25,1.25; 22 4.25,1.75; 23 4.25,2.25; 24 4.25,2.75; 37 -4.25,2.75; 38 -4.25,2.25; 39 -4.25,1.75; 40 -4.25,1.25; 41 -4.25,0.75; 42 -4.25,0.25; 43 -4.25,-0.25; 44 -4.25,-0.75; 45 -4.25,-1.25; 46 -4.25,-1.75; 47 -4.25,-2.25; 48 -4.25,-2.75

### Placement (x,y rotation side)
C1  61.28,76.83 90 top
C2  23.5,74.93 90 top
C3  33.34,70.8 0 top
C4  22.23,62.87 270 top
C5  30.16,61.59 0 top
C6  44.77,58.74 90 top
C7  46.04,58.74 90 top
C8  74.3,57.15 270 top
C9  21.59,53.66 180 top
C10  29.21,53.66 0 top
C11  59.37,51.12 270 top
C12  60.96,51.12 270 top
C13  48.26,48.58 180 top
C14  54.61,48.58 0 top
C15  65.56,47.15 90 top
C16  48.26,38.42 180 top
C17  54.61,38.42 0 top
C18  51.44,38.42 0 top
C19  74.14,32.54 90 top
C20  26.35,30.48 270 top
C21  52.07,27.62 270 top
C22  56.2,26.67 0 top
C23  48.9,25.72 90 top
C24  44.45,22.86 90 top
C25  61.91,22.54 180 top
C26  14.29,23.5 180 top
C27  56.2,18.73 90 top
C28  26.04,17.78 270 top
C29  52.39,16.19 270 top
C30  61.91,15.24 180 top
C31  11.75,53.66 180 top
D1  70.48,22.54 90 top
D2  70.48,16.19 90 top
DISP1  16.19,90.17 0 top
DISP2  41.59,90.17 0 top
IC1  54.61,73.03 0 top
IC2  67.31,73.03 0 top
IC3  73.34,60.64 0 top
IC4  51.44,56.2 0 top
IC5  59.69,56.2 0 top
IC6  73.66,47.31 0 top
IC7  MCP6004  [SO14']  51.44,43.5 0 top
IC8  14.29,26.04 0 top
IC9  TL074D  [SO14']  26.04,24.13 0 top
IC10  52.7,22.23 0 top
J1  6.35,6.35 90 top
J2  19.05,6.35 90 top
J3  31.75,6.35 90 top
J4  44.45,6.35 90 top
J5  57.15,6.35 90 top
J6  72.39,6.35 270 top
JP1  74.93,19.37 0 bottom
JP2  5.71,71.75 180 bottom
JP3  17.78,77.47 0 bottom
Q1  8.57,102.23 90 top
Q2  16.83,102.23 90 top
Q3  25.08,102.23 90 top
Q4  52.07,102.23 90 top
Q5  25.4,57.47 180 top
Q6  23.81,48.26 0 top
R1  11.75,102.23 270 top
R2  20,102.23 270 top
R3  28.26,102.23 270 top
R4  32.7,102.23 270 top
R5  35.24,102.23 270 top
R6  37.78,102.23 270 top
R7  40.32,102.23 270 top
R8  42.86,102.23 270 top
R9  45.4,102.23 270 top
R10  48.9,102.23 270 top
R11  55.24,102.23 270 top
R12  56.83,82.87 180 top
R13  33.97,78.11 90 top
R14  36.51,78.11 90 top
R15  39.05,78.11 90 top
R16  41.59,78.11 90 top
R17  44.13,78.11 90 top
R18  46.67,78.11 90 top
R19  12.7,62.87 180 top
R20  39.37,62.87 180 top
R21  66.04,62.87 180 top
R22  5.08,60.64 90 top
R23  72.71,57.15 90 top
R24  65.09,53.98 0 top
R25  48.26,49.85 180 top
R26  54.61,49.85 0 top
R27  21.27,48.26 270 top
R28  45.09,46.99 0 top
R29  20.64,46.04 0 top
R30  45.09,45.4 0 top
R31  45.09,43.5 0 top
R32  45.09,41.91 0 top
R33  4.45,40.01 90 top
R34  48.26,37.15 180 top
R35  54.61,37.15 0 top
R36  12.7,36.2 180 top
R37  39.37,36.2 180 top
R38  66.04,36.2 180 top
R39  48.26,35.56 0 top
R40  54.61,35.56 0 top
R41  48.26,33.97 0 top
R42  54.61,33.97 0 top
R43  22.86,29.21 180 top
R44  29.21,29.21 0 top
R45  56.2,28.57 0 top
R46  53.66,27.62 90 top
R47  33.66,26.04 180 top
R48  39.37,22.54 90 top
R49  67.63,21.91 270 top
R50  48.9,20.32 270 top
R51  15.88,21.91 180 top
R52  22.86,19.05 180 top
R53  29.21,19.05 0 top
R54  29.21,17.46 180 top
R55  50.8,16.19 90 top
R56  53.98,16.19 90 top
SW1  66.04,90.17 0 top
SW2  4.45,55.56 270 top
SW3  4.45,45.09 270 top
UC1  26.67,67.94 0 top

### Tracks (layer width: path | path; a pad name or v marks a point on that pad's centre or on a via)
+3V3  (via drill 0.6)
  Top 0.254: IC1.16 50.16,74.93 50.48,74.61 57.78,74.61 | 62.87,74.61 70.17,74.61 70.48,74.93 IC2.10 | IC2.16 62.87,74.61 | 62.87,74.61 61.28,74.61 | 61.28,74.61 61.28,75.88 | 61.28,74.61 57.78,74.61 | 57.78,74.61 IC1.10 | C2.1 23.5,73.34 23.92,72.92 UC1.36 | R27.2 21.17,47.31 v18.41,47.31 | IC4.14 47.47,58.95 | 32.38,70.91 32.17,70.69 UC1.24 | UC1.48 22.42,63.91 C4.1 22.25,63.7 UC1.1 | UC1.9 27.92,62.88 28.26,62.55 28.57,62.55 29.21,61.91 29.21,61.7 C5.1 29.53,61.38 v29.53,60.33 | IC5.1 58.74,53.77 58.74,53.02 59.37,52.39 C11.1 | SW3.B' SW3.B 4.54,48.48 4.13,48.9 4.13,61.28 4.34,61.49 R22.2 5.18,61.59 | 5.18,61.59 6.03,61.59 6.67,60.96 7.62,60.96 9.53,59.05 16.83,59.05 | 5.18,61.59 5.08,61.7 v5.08,62.87 | R19.P$1 15.21,55.88 16.83,55.88
  Top 0.406: v60.01,79.69 60.01,76.2 60.33,75.88 61.17,75.88 C1.1 61.39,76.1 IC2.16 | v59.37,65.09 59.69,65.41 63.5,65.41 64.45,64.45 66.04,64.45 66.67,63.82 68.26,63.82 69.85,65.41 72.07,65.41 76.52,60.96 76.52,54.93 75.88,54.29 71.6,54.29 66.5,49.2 C15.+ | 32.38,70.91 C3.1 32.49,71.33 32.38,71.44 v32.38,72.07 | C4.1 22.01,63.5 20.95,63.5 v20.95,63.82 20.95,61.91 18.73,59.69 17.46,59.69 16.83,59.05 16.83,55.88 16.83,54.93 v18.41,53.34 | C6.1 44.03,57.89 43.81,58.1 36.51,58.1 v35.56,59.05 35.24,58.74 35.24,51.75 26.67,43.18 v18.41,43.18 | C6.1 44.77,57.15 45.4,56.52 48.26,56.52 49.53,55.24 56.83,55.24 57.78,54.29 57.78,46.35 | v56.83,40.32 56.83,43.81 57.78,44.77 57.78,46.35 | 57.78,46.35 58.74,46.35 60.8,48.42 64.93,48.42 | C11.1 C12.1 61.06,52.07 61.59,52.07 62.23,51.44 62.23,49.85 62.88,49.2 64.93,49.2 | v20.95,73.03 22.01,74.08 C2.1 | 64.93,49.2 C15.+ | 64.93,48.42 64.93,49.2 | 64.93,48.42 66.83,48.42 68.58,50.16 73.18,50.16 73.54,49.81 IC6.3 | 65.56,49.85 66.04,49.85 | 65.56,49.85 | C15.+ 65.56,49.85 | C6.1 C7.1 46.09,57.94 47.31,57.94 47.62,58.26 IC4.14 | C15.+ 65.56,49.37 72.49,56.3 R23.1 | v50.8,36.83 50.59,37.05 C18.1 50.59,38.52 51.44,39.37 IC7.4
  Bottom 0.254: v5.08,62.87 5.08,64.77 4.45,65.41 JP2.1
  Bottom 0.406: v60.01,79.69 60.33,79.38 60.33,73.03 59.37,72.07 v59.37,65.09 | v20.95,63.82 v20.95,73.03 | v56.83,40.32 53.34,36.83 v50.8,36.83 | v18.41,53.34 v18.41,47.31 v18.41,43.18 | v35.56,59.05 30.8,59.05 v29.53,60.33 29.53,68.9 32.38,71.75 v32.38,72.07
ADC_MISO
  Top 0.254: IC4.10 52.7,60.33 51.75,61.28 48.26,61.28 44.45,65.09 36.83,65.09 36.2,65.72 33.66,65.72 32.68,66.69 UC1.16
ADC_MOSI
  Top 0.254: IC4.9 53.98,60.33 52.39,61.91 48.58,61.91 44.77,65.72 37.15,65.72 36.51,66.36 33.97,66.36 33.13,67.19 UC1.17
ADC_SCK
  Top 0.254: IC4.11 51.44,60.01 50.8,60.64 47.94,60.64 47.62,60.96 43.5,60.96 40.01,64.45 36.51,64.45 35.88,65.09 33.34,65.09 32.23,66.19 UC1.15
ADC_SS
  Top 0.254: IC4.8 55.24,60.33 53.02,62.55 48.9,62.55 45.09,66.36 37.47,66.36 36.83,66.99 34.29,66.99 33.59,67.69 UC1.18
AREF
  Top 0.254: IC4.13 48.9,56.83 49.85,55.88 59.37,55.88 | IC5.2 59.37,53.8 59.37,55.88 | 59.37,55.88 60.96,55.88 63.08,58 R23.2 | R23.2 C8.1 | R23.2 72.39,58.31 IC3.1 | R23.2 72.61,58.1
AREF_-10  (via drill 0.6)
  Top 0.254: R38.P$1 68.58,29.23 68.58,30.48 67.31,31.75 55.24,31.75 53.98,30.48 50.48,30.48 v50.16,30.16 | v39.69,34.92 41.27,33.34 44.77,33.34 45.09,33.02 51.75,33.02 v52.07,33.34 52.7,33.97 52.7,35.24 53.02,35.56 R40.1
  Top 0.406: R20.P$1 41.87,54.57 v36.2,48.9 26.04,38.73 23.18,38.73 15.2,30.76 R36.P$1 15.2,24.97 IC8.2 15.24,23.59 C26.1 15.14,22.02 R51.2
  Bottom 0.254: v50.16,30.16 52.07,32.07 v52.07,33.34 | v39.69,34.92 39.69,45.4 v36.2,48.9
AUDIO_OUT  (via drill 0.6)
  Top 0.254: v61.91,53.34 61.28,53.98 60.84,53.98 IC5.4 IC5.3 | v61.91,45.72 61.91,43.81 62.23,43.5 62.23,41.91 58.42,38.1 58.42,35.24 v58.1,34.92 | v58.42,28.26 58.1,28.57 R45.2
  Bottom 0.254: v61.91,45.72 62.23,46.04 62.23,51.75 61.91,52.07 v61.91,53.34 | v58.42,28.26 58.42,34.61 v58.1,34.92
BOOT_FLASH
  Top 0.254: UC1.44 19.57,67.19 17.78,65.41 11.11,65.41 10.32,64.61 5.24,64.61 3.49,62.87 3.49,48.9 3.17,48.58 2.54,48.58 SW3.A 2.44,42.23 | SW3.A' 2.44,42.23 | R33.2 4.45,41.59 3.81,42.23 2.44,42.23
DAC_MOSI
  Top 0.254: IC5.7 59.37,58.6 59.37,59.69 54.61,64.45 49.85,64.45 46.04,68.26 39.37,68.26 38.73,68.9 38.73,71.12 34.92,74.93 29.53,74.93 27.92,73.32 UC1.28
DAC_SCK
  Top 0.254: 60.01,58.59 IC5.6 60.02,57.79 59.85,57.63 57.63,57.63 56.67,58.58 56.67,60.8 53.66,63.82 49.53,63.82 45.72,67.63 39.05,67.63 38.1,68.58 38.1,70.8 34.61,74.3 29.84,74.3 28.92,73.37 UC1.26
DAC_SS
  Top 0.254: IC5.5 60.64,58.58 60.64,57.31 60.33,56.99 57.47,56.99 56.04,58.42 56.04,60.48 53.34,63.18 49.21,63.18 45.4,66.99 38.73,66.99 37.47,68.26 37.47,70.48 34.29,73.66 30.16,73.66 29.42,72.92 UC1.25
DISP_CHAR0
  Top 0.254: R3.1 28.26,104.14 26.99,105.41 5.08,105.41 3.49,103.82 3.49,85.41 1.59,83.5 1.59,66.36 2.86,65.09 9.84,65.09 10.79,66.04 17.46,66.04 19.12,67.69 UC1.43
DISP_CHAR1  (via drill 0.6)
  Top 0.254: R11.1 55.35,103.19 56.2,103.19 56.52,102.87 56.52,99.06 52.7,95.25 49.21,95.25 46.04,92.08 27.62,92.08 26.67,91.12 6.67,91.12 5.4,89.85 5.4,84.45 3.49,82.55 3.49,67.31 3.81,66.99 6.67,66.99 7.3,67.63 v8.89,67.63 | v11.11,64.14 11.75,64.77 18.1,64.77 20.02,66.69 UC1.45
  Bottom 0.254: v8.89,67.63 11.11,65.41 v11.11,64.14
DISP_CHAR2
  Top 0.254: R1.1 11.75,103.82 11.43,104.14 5.71,104.14 4.76,103.19 4.76,84.77 2.86,82.87 2.86,66.99 3.49,66.36 9.21,66.36 10.16,67.31 16.83,67.31 18.21,68.69 UC1.41
DISP_CHAR3
  Top 0.254: R2.1 20,103.82 19.05,104.78 5.4,104.78 4.13,103.5 4.13,85.09 2.22,83.19 2.22,66.67 3.17,65.72 9.53,65.72 10.48,66.67 17.14,66.67 18.66,68.19 UC1.42
DISP_EN  (via drill 0.6)
  Top 0.254: v67.94,79.06 IC2.12 | v67.31,65.09 67.31,65.41 66.04,66.67 61.91,66.67 61.59,66.99 59.05,66.99 58.42,66.36 v56.83,66.36 56.52,66.67 55.24,66.67 53.98,67.94 48.26,67.94 46.67,69.53 41.27,69.53 v40.64,70.17 | v55.24,79.06 IC1.12 | v35.24,68.58 34.92,68.9 32.07,68.9 31.77,69.19 UC1.21
  Bottom 0.254: v67.31,65.09 67.63,65.41 67.63,78.74 v67.94,79.06 | v56.83,66.36 56.83,67.63 57.47,68.26 57.47,76.52 56.83,77.15 55.88,77.15 55.24,77.79 v55.24,79.06 | v40.64,70.17 39.05,70.17 38.73,69.85 37.47,69.85 36.51,68.9 35.56,68.9 v35.24,68.58
DISP_SCK  (via drill 0.6)
  Top 0.254: v69.22,78.11 IC2.11 | v68.58,65.72 68.26,66.04 67.63,66.04 66.36,67.31 62.23,67.31 61.91,67.63 58.1,67.63 | v56.52,78.11 IC1.11 | 58.1,67.63 55.24,67.63 54.29,68.58 48.58,68.58 46.99,70.17 42.55,70.17 v41.91,70.8 | 58.1,67.63 v58.1,67.31 | v36.2,69.85 35.88,69.53 32.38,69.53 32.22,69.69 UC1.22
  Bottom 0.254: v68.58,65.72 68.26,66.04 68.26,77.15 v69.22,78.11 | v58.1,67.31 58.1,77.15 57.15,78.11 v56.52,78.11 | v41.91,70.8 41.59,71.12 39.05,71.12 38.42,70.48 37.15,70.48 36.51,69.85 v36.2,69.85
DISP_SER  (via drill 0.6)
  Top 0.254: v65.41,79.06 IC2.14 | v65.41,65.72 65.09,66.04 61.59,66.04 61.28,66.36 59.37,66.36 58.74,65.72 57.78,65.72 57.47,65.41 56.2,65.41 55.56,66.04 54.93,66.04 53.66,67.31 47.94,67.31 46.35,68.9 40.01,68.9 v39.69,69.22 | v36.51,67.94 36.2,67.63 34.61,67.63 34.04,68.19 UC1.19
  Bottom 0.254: v65.41,65.72 64.77,66.36 64.77,78.42 v65.41,79.06 | v36.51,67.94 37.78,69.22 v39.69,69.22
ENC_A  (via drill 0.6)
  Top 0.254: v24.77,59.69 24.77,60.96 24.92,61.12 UC1.3 | v25.08,88.27 25.72,88.27 26.67,89.22 28.26,89.22 29.21,88.27 35.56,88.27 36.2,87.63 40.32,87.63 40.96,87 42.55,87 43.18,86.36 44.77,86.36 45.4,85.72 46.99,85.72 47.62,85.09 52.07,85.09 52.7,84.45 67.63,84.45 68.54,83.54 SW1.B
  Bottom 0.254: v24.77,59.69 24.77,60.96 25.08,61.28 v25.08,88.27
ENC_B  (via drill 0.6)
  Top 0.254: v25.72,60.64 25.72,61.28 25.42,61.58 UC1.4 | v27.62,88.27 28.26,87.63 35.24,87.63 35.88,87 40.01,87 40.64,86.36 42.23,86.36 42.86,85.72 44.45,85.72 45.09,85.09 46.67,85.09 47.31,84.45 51.75,84.45 52.39,83.82 63.18,83.82 63.5,83.5 63.54,83.5 SW1.A
  Bottom 0.254: v25.72,60.64 25.72,80.33 27.62,82.23 v27.62,88.27
ENC_CLICK  (via drill 0.6)
  Top 0.254: v69.22,84.45 68.58,85.09 53.02,85.09 52.39,85.72 47.94,85.72 47.31,86.36 45.72,86.36 45.09,87 43.5,87 42.86,87.63 41.27,87.63 40.64,88.27 36.51,88.27 35.88,88.9 29.53,88.9 28.57,89.85 24.77,89.85 v22.54,87.63 | v23.81,60.96 24.42,61.57 UC1.2
  Bottom 0.254: v23.81,60.96 24.45,61.59 24.45,80.33 22.54,82.23 v22.54,87.63 | v69.22,84.45 67.94,85.72 67.94,96.5 68.54,97.09 SW1.E
FINE_TUNE
  Top 0.254: UC1.13 31.32,65.19 32.07,64.45 32.07,60.96 33.97,59.05 33.97,53.98 31.11,51.12 23.81,51.12 23.5,50.8 13.97,50.8 12.6,52.17 C31.1 12.7,53.76 R19.P$2
FM_CV
  Top 0.254: IC4.4 51.44,52.39 51.75,52.07 56.52,52.07 57.15,51.44 57.15,45.09 55.24,43.18 IC7.7 55.24,38.63 C17.2 R35.2
GATE
  Top 0.254: R27.1 21.52,49.36 Q6.C 23.81,50.31 23.98,50.48 31.43,50.48 34.61,53.66 34.61,59.37 32.7,61.28 32.7,64.77 31.78,65.69 UC1.14
GND  (via drill 0.6)
  Top 0.254: UC1.20 29.73,68.69 29.61,68.58 29.21,68.58 | 29.24,70.19 UC1.23 | UC1.8 27.42,65.61 | C2.2 23.6,75.88 | UC1.35 24.42,73.66 | v19.68,64.77 20.61,65.69 UC1.47
  other vias: 6.67,100.33 13.65,102.23 21.91,102.23 56.2,97.16 60.64,69.85 71.75,72.39 53.98,78.11 66.67,78.11 62.87,78.74 23.18,59.37 31.11,63.5 26.67,53.66 24.13,53.66 57.63,59.85 52.07,56.83 43.18,59.69 73.03,42.55 68.58,60.64 33.97,72.39 51.44,42.55 51.44,48.9 64.45,24.45 51.75,35.56 27.94,31.43 24.45,17.14 56.52,53.34 59.05,48.58 50.8,65.72 66.04,60.64 27.3,78.74 7.3,86.04 51.75,87 44.77,52.7 39.37,48.9 34.92,43.81 29.84,38.73 36.51,27.3 42.55,21.91 56.2,16.19 40.64,39.69 40.64,37.47 59.69,41.27 60.96,33.66 12.7,62.87 27.3,69.22 5.4,55.88 1.91,55.88 17.78,26.04 11.11,93.34 22.23,75.88 20.64,59.37 47.31,26.67 53.98,21.59 24.45,36.2 19.68,49.85 17.14,49.85 69.53,43.81 39.69,72.71 69.22,12.38 4.45,46.99 31.11,27.3 46.04,40.01 73.34,27.94 25.4,22.86 36.83,39.69 23.18,31.43 28.26,65.72 69.22,72.07 36.83,37.47 6.35,1.27 16.51,1.27 26.67,1.27 36.83,1.27 46.99,1.27 57.15,1.27 67.31,1.27 77.47,1.27 1.27,11.43 1.27,24.13 1.27,34.29 1.27,62.23 1.27,95.25 1.27,105.41 77.47,105.41 67.31,105.41 57.15,105.41 46.99,105.41 29.21,105.41 1.27,85.09 77.47,95.25 77.47,85.09 77.47,74.93 77.47,64.77 77.47,54.61 77.47,44.45 77.47,34.29 11.43,46.99 36.83,19.05 29.21,49.53 44.45,13.97 59.37,17.14 11.75,23.5 75.25,60.64 22.23,78.74 67.63,46.67 60.64,46.67 61.59,54.93 67.31,53.02
  pour Bottom: 0,106.68 0,0 78.74,0 78.74,106.68
  pour Top (isolate 0.203): 0,106.68 0,0 78.74,0 78.74,106.68
JTCK  (via drill 0.6)
  Top 0.254: v8.89,69.22 8.57,69.53 6.67,69.53 6.35,69.22 JP2.4 | v8.89,71.75 18.73,71.75 19.79,70.69 UC1.37
  Bottom 0.254: v8.89,69.22 8.57,69.22 8.57,71.44 v8.89,71.75
JTDI
  Top 0.254: UC1.38 19.34,70.19 18.73,70.8 7.3,70.8 6.35,71.75 JP2.8
JTDO
  Top 0.254: UC1.39 18.89,69.69 18.41,70.17 6.67,70.17 6.35,70.48 JP2.6
JTMS  (via drill 0.6)
  Top 0.254: UC1.34 24.92,71.28 24.45,70.8 23.81,70.8 23.18,71.44 20,71.44 18.73,72.71 v7.62,72.71 | v7.62,68.58 6.99,68.58 6.35,67.94 JP2.2
  Bottom 0.254: v7.62,68.58 7.94,68.9 7.94,72.39 v7.62,72.71
N$1
  Top 0.254: Q3.C 24.13,102.09 24.13,101.28 25.08,100.33 29.21,100.33 30.16,101.28 30.16,104.14 31.43,105.41 35.88,105.41 36.51,104.78 DISP2.16
N$2
  Top 0.254: DISP2.11 49.21,99.06 50.97,100.82 Q4.C
N$3
  Top 0.254: DISP1.16 11.11,99.06 10.48,99.69 9.21,99.69 7.47,101.43 Q1.C
N$4
  Top 0.254: DISP1.11 23.81,99.06 23.18,99.69 17.46,99.69 15.73,101.43 Q2.C
N$5
  Top 0.254: R3.2 28.16,101.28 Q3.B
N$6
  Top 0.254: R11.2 55.15,101.28 Q4.B
N$7
  Top 0.254: UC1.5 25.92,62.03 26.67,61.28 26.67,59.69 24.45,57.47 Q5.2 20.57,56.9 20.64,56.83 20.64,53.76 C9.2
N$8
  Top 0.254: UC1.6 26.42,62.48 27.3,61.59 27.3,59.69 29.53,57.47 Q5.1 30.06,57.3 C10.2
N$9
  Top 0.254: Q1.B 9.77,101.39 R1.2
N$10
  Top 0.254: Q2.B 18.03,101.39 R2.2
N$12  (via drill 0.6)
  Top 0.254: v32.38,34.61 32.38,36.51 34.29,38.42 43.18,38.42 43.5,38.1 44.77,38.1 45.72,37.15 45.72,34.29 46.04,33.97 R41.1 | v32.7,22.54 30.16,22.54 29.84,22.23 IC9.7 29.84,19.27 R53.2
  Bottom 0.254: v32.7,22.54 33.02,22.86 33.02,30.48 32.38,31.11 v32.38,34.61
N$13  (via drill 0.6)
  Top 0.254: R20.P$2 39.37,57.15 39.69,57.47 42.86,57.47 43.5,56.83 43.5,53.66 41.91,52.07 v41.91,48.9 | v41.91,40.64 43.81,38.73 45.09,38.73 46.35,37.47 46.35,35.88 46.67,35.56 R39.1
  Bottom 0.254: v41.91,40.64 v41.91,48.9
N$14  (via drill 0.6)
  Top 0.254: R54.1 30.16,17.36 30.16,14.61 24.77,9.21 v18.73,9.21
  Bottom 0.254: v18.73,9.21 15.88,6.35 J2.P3
N$15  (via drill 0.6)
  Top 0.254: R9.2 45.4,100.97 46.67,99.69 DISP2.12 46.67,97.16 42.86,93.34 21.59,93.34 v21.27,93.03
  Bottom 0.254: v21.27,93.03 DISP1.12
N$16  (via drill 0.6)
  Top 0.254: v26.35,92.39 26.67,92.71 44.13,92.71 47.94,96.52 51.12,96.52 51.75,97.16 DISP2.10 51.75,100.33 52.07,100.65 52.07,103.19 50.16,103.19 49.85,102.87 49.85,101.92 49.31,101.39 R10.2
  Bottom 0.254: v26.35,92.39 DISP1.10
N$17  (via drill 0.6)
  Top 0.254: v26.35,87.31 26.67,87 34.92,87 35.56,86.36 39.69,86.36 40.32,85.72 41.91,85.72 42.55,85.09 44.13,85.09 44.77,84.45 46.35,84.45 46.99,83.82 51.12,83.82 51.75,83.19 DISP2.9 51.75,82.87 R12.2
  Bottom 0.254: DISP1.9 v26.35,87.31
N$18  (via drill 0.6)
  Top 0.254: v21.27,86.68 21.59,86.36 34.61,86.36 35.24,85.72 39.37,85.72 40.01,85.09 41.59,85.09 42.23,84.45 43.81,84.45 44.45,83.82 46.04,83.82 46.67,83.19 DISP2.7 R18.2
  Bottom 0.254: DISP1.7 v21.27,86.68
N$19
  Top 0.254: R13.2 33.97,79.69 33.02,80.64 31.43,80.64 | 31.43,80.64 DISP2.1 | DISP1.1 6.03,81.92 7.3,80.64 31.43,80.64
N$20
  Top 0.254: R4.2 32.7,100.97 31.43,99.69 DISP2.18 31.43,97.16 30.8,96.52 6.67,96.52 6.03,97.16 DISP1.18
N$21  (via drill 0.6)
  Top 0.254: R5.2 35.24,100.97 33.97,99.69 DISP2.17 33.97,97.16 32.7,95.89 8.89,95.89 v8.57,95.57
  Bottom 0.254: v8.57,95.57 DISP1.17
N$22  (via drill 0.6)
  Top 0.254: R6.2 37.78,100.97 39.05,99.69 DISP2.15 39.05,97.16 37.15,95.25 13.97,95.25 v13.65,94.93
  Bottom 0.254: v13.65,94.93 DISP1.15
N$23  (via drill 0.6)
  Top 0.254: R7.2 40.32,100.97 41.59,99.69 DISP2.14 41.59,97.16 39.05,94.61 16.51,94.61 v16.19,94.3
  Bottom 0.254: v16.19,94.3 DISP1.14
N$24  (via drill 0.6)
  Top 0.254: v18.73,86.04 19.05,85.72 34.29,85.72 34.92,85.09 39.05,85.09 39.69,84.45 41.27,84.45 41.91,83.82 43.5,83.82 44.13,83.19 DISP2.6 R17.2
  Bottom 0.254: DISP1.6 v18.73,86.04
N$25  (via drill 0.6)
  Top 0.254: v16.19,85.41 16.51,85.09 33.97,85.09 34.61,84.45 38.73,84.45 39.37,83.82 40.96,83.82 41.59,83.19 DISP2.5 R16.2
  Bottom 0.254: DISP1.5 v16.19,85.41
N$26  (via drill 0.6)
  Top 0.254: v13.65,84.77 13.97,84.45 33.66,84.45 34.29,83.82 38.42,83.82 39.05,83.19 DISP2.4 R15.2
  Bottom 0.254: DISP1.4 v13.65,84.77
N$27
  Top 0.254: DISP1.2 8.57,83.19 9.21,83.82 33.34,83.82 33.97,83.19 DISP2.2 33.97,81.28 34.92,80.33 35.88,80.33 36.51,79.69 R14.2
N$28  (via drill 0.6)
  Top 0.254: R8.2 42.86,100.97 44.13,99.69 DISP2.13 44.13,97.16 40.96,93.98 19.05,93.98 v18.73,93.66
  Bottom 0.254: v18.73,93.66 DISP1.13
N$29
  Top 0.254: IC7.2 48.9,38.63 C16.1 R34.1 R39.2 R41.2
N$30  (via drill 0.6)
  Top 0.254: IC2.7 70.48,72.71 72.71,74.93 72.71,84.45 70.17,87 56.83,87 53.66,90.17 40.64,90.17 v40.32,89.85 | v40.32,99.69 39.05,100.97 39.05,102.55 38.52,103.08 R6.1
  Bottom 0.254: v40.32,89.85 v40.32,99.69
N$31  (via drill 0.6)
  Top 0.254: IC1.14 52.7,79.38 53.34,80.01 57.15,80.01 v58.74,78.42 | v59.05,73.66 59.37,73.98 70.8,73.98 71.75,74.93 IC2.9
  Bottom 0.254: v58.74,78.42 59.05,78.11 v59.05,73.66
N$32  (via drill 0.6)
  Top 0.254: IC2.15 64.14,79.38 64.77,80.01 69.85,80.01 70.8,80.96 70.8,85.41 69.85,86.36 56.52,86.36 53.98,88.9 49.53,88.9 v49.21,89.22 | v47.94,99.69 46.99,100.65 46.99,102.23 46.14,103.08 R9.1
  Bottom 0.254: v49.21,89.22 49.21,92.71 47.94,93.98 v47.94,99.69
N$33  (via drill 0.6)
  Top 0.254: IC2.1 62.87,68.58 66.99,68.58 68.26,67.31 73.34,67.31 74.61,68.58 74.61,90.81 72.07,93.34 58.1,93.34 v57.47,92.71 | v58.1,94.93 58.1,102.87 56.2,104.78 49.85,104.78 48.9,103.82 R10.1
  Bottom 0.254: v57.47,92.71 58.1,93.34 v58.1,94.93
N$34  (via drill 0.6)
  Top 0.254: v61.28,82.87 R12.1 | IC2.2 64.14,71.12 63.82,71.44 61.91,71.44 v61.59,71.12
  Bottom 0.254: v61.59,71.12 61.28,71.44 v61.28,82.87
N$35  (via drill 0.6)
  Top 0.254: IC2.3 65.41,71.12 64.45,72.07 54.29,72.07 53.02,73.34 49.85,73.34 48.9,74.3 47.31,74.3 v46.35,75.25 | v47.94,80.64 47.94,77.79 47.41,77.25 R18.1
  Bottom 0.254: v46.35,75.25 46.35,79.06 v47.94,80.64
N$36
  Top 0.254: IC2.4 66.67,71.12 65.09,72.71 54.93,72.71 53.66,73.98 50.16,73.98 49.21,74.93 48.26,74.93 46.99,76.2 34.29,76.2 33.97,76.52 R13.1
N$37  (via drill 0.6)
  Top 0.254: IC2.5 67.94,68.58 68.58,67.94 73.03,67.94 73.98,68.9 73.98,90.49 71.75,92.71 59.05,92.71 57.78,91.44 33.02,91.44 v32.7,91.12 | R4.1 32.8,103.19 33.34,103.19 33.97,102.55 33.97,100.97 v32.7,99.69
  Bottom 0.254: v32.7,91.12 v32.7,99.69
N$38  (via drill 0.6)
  Top 0.254: IC2.6 69.22,68.58 72.39,68.58 73.34,69.53 73.34,84.77 70.48,87.63 57.15,87.63 53.98,90.81 35.56,90.81 v35.24,90.49 | R5.1 35.24,103.82 34.92,104.14 v33.97,104.14
  Bottom 0.254: v35.24,90.49 35.24,102.87 v33.97,104.14
N$39  (via drill 0.6)
  Top 0.254: IC1.15 51.44,79.38 52.7,80.64 69.53,80.64 70.17,81.28 70.17,85.09 69.53,85.72 56.2,85.72 53.66,88.27 45.09,88.27 43.81,89.53 43.18,89.53 v42.86,89.22 | v42.86,99.69 41.59,100.97 41.59,102.55 41.06,103.08 R7.1
  Bottom 0.254: v42.86,89.22 v42.86,99.69
N$40  (via drill 0.6)
  Top 0.254: IC1.1 50.16,70.48 49.85,70.8 48.58,70.8 47.62,71.75 44.77,71.75 v44.45,72.07 | v45.4,80.64 45.4,77.79 44.87,77.25 R17.1
  Bottom 0.254: v44.45,72.07 45.4,73.03 v45.4,80.64
N$41  (via drill 0.6)
  Top 0.254: IC1.2 51.44,71.12 51.12,71.44 48.9,71.44 47.94,72.39 45.72,72.39 44.45,73.66 v42.86,73.66 | v42.86,80.64 42.86,77.79 42.33,77.25 R16.1
  Bottom 0.254: v42.86,73.66 v42.86,80.64
N$42  (via drill 0.6)
  Top 0.254: IC1.3 52.7,71.12 51.75,72.07 49.21,72.07 48.26,73.03 46.04,73.03 44.13,74.93 40.64,74.93 v40.32,74.61 | v40.32,80.64 40.32,77.79 39.79,77.25 R15.1
  Bottom 0.254: v40.32,74.61 v40.32,80.64
N$43  (via drill 0.6)
  Top 0.254: IC1.4 53.98,71.12 52.39,72.71 49.53,72.71 48.58,73.66 46.35,73.66 44.45,75.56 38.1,75.56 v37.78,75.25 | v37.78,80.64 37.78,77.79 37.25,77.25 R14.1
  Bottom 0.254: v37.78,75.25 v37.78,80.64
N$44  (via drill 0.6)
  Top 0.254: IC1.5 55.24,68.58 55.56,68.26 62.23,68.26 62.55,67.94 66.67,67.94 67.94,66.67 73.66,66.67 75.25,68.26 75.25,91.12 72.39,93.98 49.53,93.98 v47.94,92.39 | v45.4,99.69 44.13,100.97 44.13,102.55 43.6,103.08 R8.1
  Bottom 0.254: v47.94,92.39 45.4,94.93 v45.4,99.69
N$45
  Top 0.254: R54.2 R53.1 28.57,19.27 IC9.6
N$46  (via drill 0.6)
  Top 0.254: v34.61,21.91 34.61,16.51 27.3,9.21 J3.P3 | v34.29,32.38 34.61,32.7 36.83,32.7 37.47,32.07 44.13,32.07 44.45,31.75 53.34,31.75 54.61,33.02 58.74,33.02 59.69,33.97 59.69,37.47 63.82,41.59 v63.82,42.86 | v63.82,52.39 64.24,52.81 R24.1
  Bottom 0.254: v63.82,52.39 63.5,52.07 63.5,45.4 63.82,45.09 v63.82,42.86 | v34.61,21.91 35.24,22.54 35.24,24.77 34.29,25.72 v34.29,32.38
N$47
  Top 0.254: R48.1 39.37,20.88 39.65,20.6 39.69,20.56 39.69,8.26 40.01,7.94 J4.P3
N$48
  Top 0.254: R24.2 66.04,54.08 R21.P$2
N$49
  Top 0.406: 74.14,34.13 74.14,33.81 | IC6.2 75.94,40.06 73.98,38.1 73.98,34.75 C19.+ 74.14,34.13 | R49.1 67.63,24.77 71.12,28.26 71.12,31.11 74.14,34.13
N$50
  Top 0.254: R37.P$1 41.87,28.54 38.42,25.08 33.66,25.08 33.34,24.77 28.26,24.77 27.94,25.08 24.45,25.08 23.5,26.04 IC9.13 23.5,29 R43.1
N$51
  Top 0.254: R30.1 38.42,45.4 27.3,34.29 24.45,34.29 22.01,31.85 R43.2 22.23,29 IC9.14
N$52  (via drill 0.6)
  Top 0.254: v65.09,41.91 63.82,40.64 63.82,34.92 61.28,32.38 54.93,32.38 53.66,31.11 44.13,31.11 43.81,31.43 36.83,31.43 36.2,32.07 35.88,32.07 v35.56,31.75 | v36.2,23.18 33.66,23.18 33.34,23.5 27.62,23.5 27.3,23.81 24.77,23.81 23.5,22.54 IC9.2 23.5,19.27 R52.1
  Bottom 0.254: v65.09,41.91 65.09,43.18 64.45,43.81 64.45,45.4 64.14,45.72 64.14,51.44 66.99,54.29 67.94,54.29 68.58,54.93 68.54,54.97 R21.P$1 | v35.56,31.75 34.92,31.11 34.92,26.04 35.88,25.08 35.88,23.5 v36.2,23.18
N$53  (via drill 0.6)
  Top 0.254: v33.34,33.66 34.29,33.66 34.61,33.34 37.47,33.34 38.1,32.7 44.45,32.7 44.77,32.38 53.02,32.38 53.76,33.12 R42.1 | R52.2 22.23,19.27 IC9.1 22.23,22.86 23.81,24.45 27.62,24.45 27.94,24.13 v34.29,24.13
  Bottom 0.254: v34.29,24.13 33.66,24.77 33.66,30.8 33.34,31.11 v33.34,33.66
N$55  (via drill 0.6)
  Top 0.254: v62.87,44.45 62.87,41.59 59.05,37.78 59.05,34.29 58.74,33.97 R42.2 R40.2 55.35,35.56 R35.1 C17.1 53.98,38.63 IC7.6
  Bottom 0.254: v62.87,44.45 62.87,53.34 63.54,54.02 R21.P$3
N$56
  Top 0.406: JP1.1 JP1.2 D1.A
N$57
  Top 0.254: J1.P3 1.91,10.16 7.62,15.88 7.62,31.75 10.79,34.92 10.79,38.73 18.1,46.04 R29.1
N$58
  Top 0.254: R31.1 40.01,43.5 39.37,42.86 36.83,42.86 30.06,36.09 R44.2 29.84,29 29.84,28.57 IC9.8
N$59  (via drill 0.6)
  Top 0.254: v38.1,43.81 39.05,43.81 39.69,44.45 45.72,44.45 45.94,44.66 R30.2 | R30.2 R28.2 | R30.2 46.67,45.4 46.99,45.09 48.58,45.09 48.9,45.4 IC7.13 48.9,48.36 C13.1 R25.1
  Bottom 0.254: v38.1,43.81 38.1,32.07 36.87,30.84 R37.P$3
N$60  (via drill 0.6)
  Top 0.254: v40.32,24.77 40.32,10.79 42.23,8.89 50.16,8.89 52.35,6.71 J5.P3 | v38.42,26.35 38.1,26.04 R47.1
  Bottom 0.254: v38.42,26.35 38.73,26.35 v40.32,24.77
N$61  (via drill 0.6)
  Top 0.254: R28.1 36.51,46.99 26.99,37.47 24.13,37.47 v17.78,31.11
  Bottom 0.254: v17.78,31.11 13.34,31.11 12.7,30.48 R36.P$2
N$62
  Top 0.254: R37.P$2 39.37,30.48 39.69,30.8 43.18,30.8 43.5,30.48 43.5,28.26 42.55,27.3 41.59,27.3 39.37,25.08 R48.2
N$63
  Top 0.254: R47.2 32.7,26.04 32.07,25.4 29.21,25.4 28.57,26.04 IC9.9 28.57,28.57 28.57,29 R44.1
N$64
  Top 0.406: JP1.9 JP1.10 71.12,14.29 71.11,14.29 D2.C
N$65  (via drill 0.6)
  Top 0.254: R38.P$2 66.04,30.48 65.72,30.8 55.24,30.8 54.29,29.84 51.75,29.84 50.48,28.57 46.99,28.57 v46.04,29.53 | R32.1 44.13,41.81 v44.13,39.69
  Bottom 0.254: v44.13,39.69 46.04,37.78 v46.04,29.53
N$66
  Top 0.254: Q6.B 22.86,46.36 22.54,46.04 R29.2
N$67
  Top 0.254: IC10.6 IC10.7 C21.2 51.02,26.77 49.85,27.94 45.72,27.94 44.45,26.67 C24.+
N$68
  Top 0.254: R50.2 47.2,19.47 45.41,21.26 C24.-
N$69
  Top 0.254: R46.1 55.24,26.77 C22.1 55.35,25.5 54.93,25.08 54.87,25.08 IC10.5
N$70
  Top 0.254: R32.2 R31.2 46.67,43.5 47.62,44.45 48.9,44.45 49.53,45.09 53.98,45.09 IC7.9 53.98,48.36 C14.1 R26.1
N$71
  Top 0.254: R45.1 55.24,28.47 R46.2 C21.1
N$72  (via drill 0.6)
  Top 0.254: 53.98,13.97 55.88,12.06 59.37,12.06 v62.55,8.89 | 53.98,13.97 R56.1 | R55.1 50.8,14.29 51.12,13.97 53.98,13.97 | v66.67,8.89 75.56,8.89 76.83,7.62 J6.P3
  Bottom 0.254: v62.55,8.89 v66.67,8.89
N$73
  Top 0.254: IC10.1 R55.2 50.8,16.93 C29.2
N$75
  Top 0.254: 48.9,21.27 R50.1 51.85,21.17 52.07,20.95 IC10.2 52.07,18.1 52.39,17.78 C29.1 R56.2
PARAM1_CV
  Top 0.254: IC4.1 47.73,53.49 47.62,53.39 47.62,51.75 47.41,51.54 R25.2 C13.2 47.62,48.36 IC7.14
PARAM2_CV
  Top 0.254: 55.14,46.67 IC7.8 55.24,48.36 C14.2 R26.2 | IC4.2 48.9,52.39 50.48,50.8 55.24,50.8 55.46,50.59 R26.2 | R26.2 55.46,49.63
PITCH_CV
  Top 0.254: IC4.3 50.16,52.39 51.12,51.44 55.88,51.44 56.52,50.8 56.52,45.4 55.56,44.45 49.85,44.45 47.62,42.23 IC7.1 47.62,38.63 C16.2 R34.2
RESET  (via drill 0.6)
  Top 0.254: UC1.7 26.92,62.93 27.94,61.91 27.94,60.33 28.89,59.37 32.7,59.37 33.34,58.74 33.34,54.29 30.8,51.75 v20,51.75 | v22.86,72.39 22.54,72.07 20.32,72.07 18.73,73.66 7.3,73.66 6.67,73.03 JP2.10 | 6.54,52.07 SW2.B' SW2.B 6.35,59.06 6.35,59.69 6.25,59.79 R22.1 v5.08,58.42
  Bottom 0.254: v22.86,72.39 23.81,71.44 23.81,62.55 21.91,60.64 21.91,53.66 v20,51.75 | v5.08,58.42 5.08,59.69 6.03,60.64 6.03,65.72 6.67,66.36 6.67,72.39 6.03,73.03 JP2.10
RX
  Top 0.254: JP3.4 10.16,78.11 10.79,78.74 19.37,78.74 20.95,77.15 24.77,77.15 26.42,75.5 UC1.31
TX
  Top 0.254: JP3.5 7.62,78.74 8.26,79.38 19.68,79.38 21.27,77.79 25.08,77.79 26.92,75.95 UC1.30
VCC  (via drill 0.6)
  Top 0.254: C28.1 26.04,18.52
  Top 0.406: IC10.8 50.76,24.87 C23.1 48.9,23.5 49.53,22.86 57.47,22.86 57.78,22.54 C25.+ 59.51,21.77 60.64,20.64 | C28.1 26.14,18.73 26.04,18.84 IC9.4 26.04,20 | C28.1 26.04,18.73 | v27.3,14.61 27.3,18.1 26.77,18.63 C28.1 | v29.21,8.89 29.21,5.74 30.98,3.97 63.34,3.97 64.45,5.08 64.45,9.84 62.23,12.06 62.23,17.46 60.64,19.05 60.64,20.64 | 60.64,20.64 67.63,20.64 | 67.63,20.64 D1.C | 67.63,20.64 R49.2
  Bottom 0.406: v29.21,8.89 29.21,12.7 v27.3,14.61
VEE  (via drill 0.6)
  Top 0.406: v62.23,19.37 63.5,18.1 63.5,14.92 | 63.5,14.92 63.5,12.38 65.25,10.64 65.25,4.6 63.82,3.17 18.26,3.17 16.73,4.71 R51.1 16.83,22.01 16.83,23.18 v20.32,26.67 | v59.05,19.37 58.74,19.37 58.52,19.58 C27.2 56.16,19.62 IC10.4 | 63.5,14.92 63.99,14.92 C30.- 64.77,15.7 64.77,16.51 66.35,18.09 D2.A | v25.08,31.43 25.4,31.11 25.4,29.84 25.61,29.63 C20.2 26.35,28.57 26.04,28.26 IC9.11
  Bottom 0.406: v62.23,19.37 v59.05,19.37 | v20.32,26.67 v25.08,31.43

### Text on the board
tNames: Braids | cc-by-sa Olivier Gillet, 2015. v5 | RESET | SYSBOOT
bNames: Braids | cc-by-sa Olivier Gillet, 2015. v5 | TX | RX | GND | +12V | GND | GND | GND | -12V | Red stripe